# EAGLE design 8085_shadow (EAGLE 7.2.0)
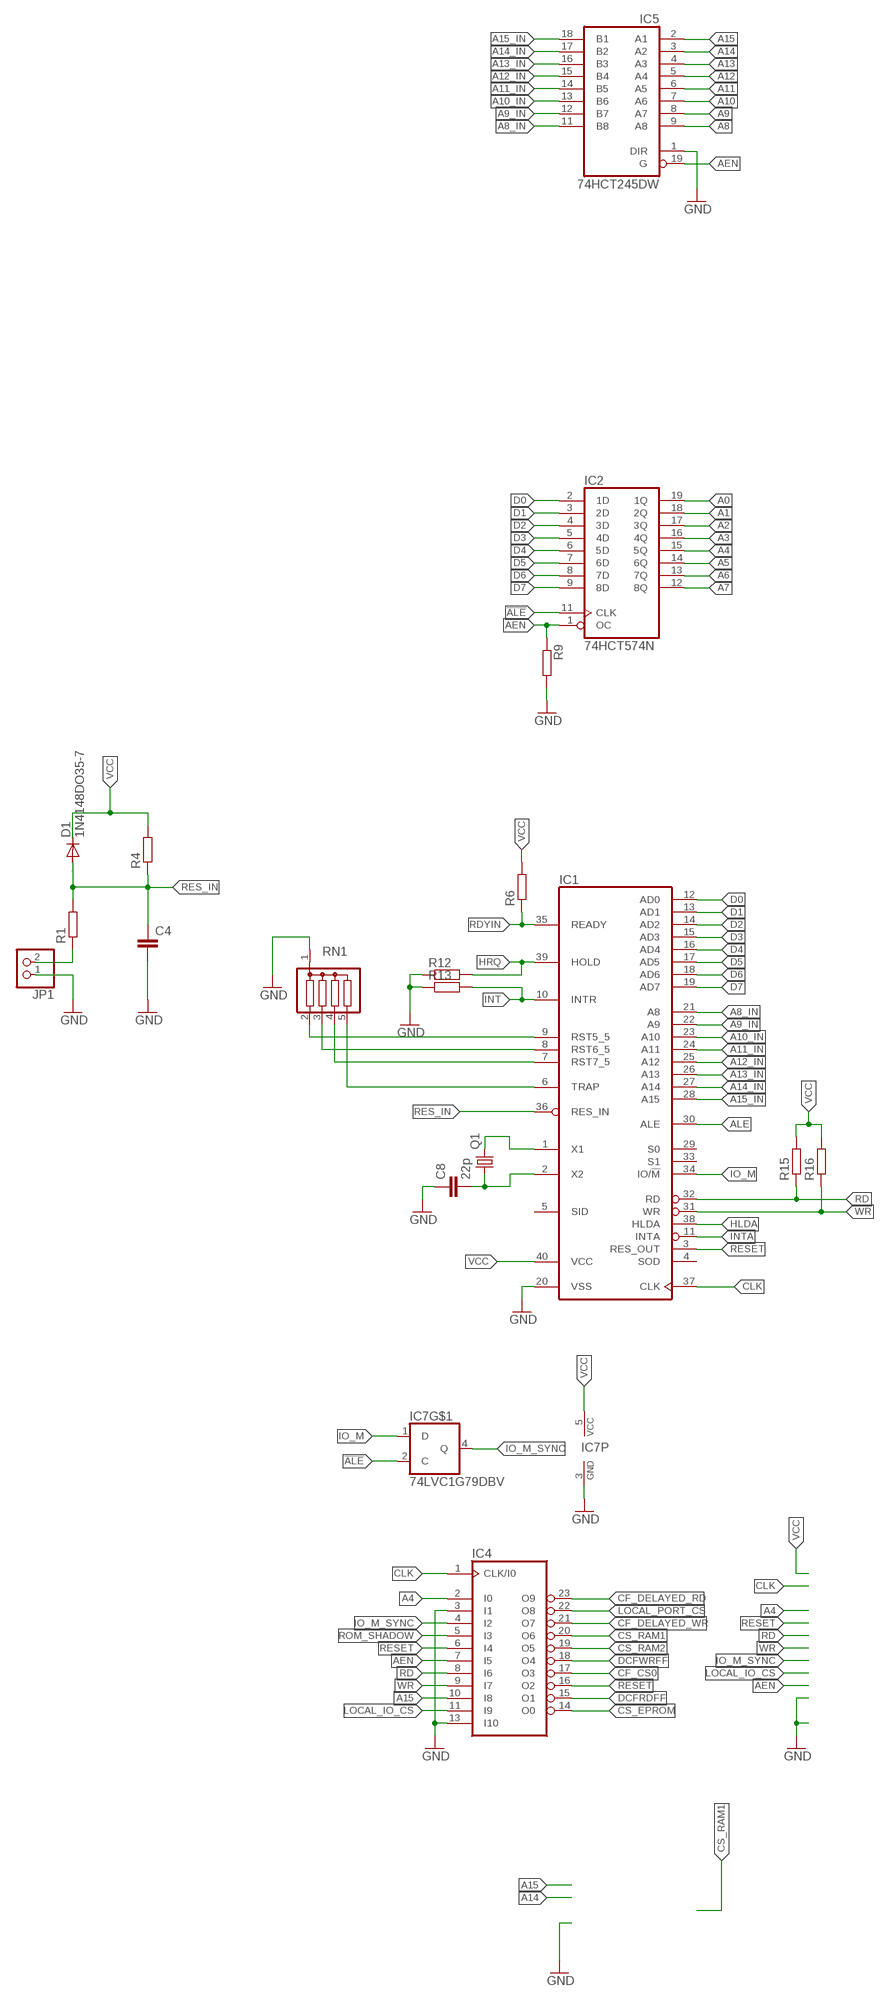
[diagram p0: schematic, sheet 1, part 1 of 3]
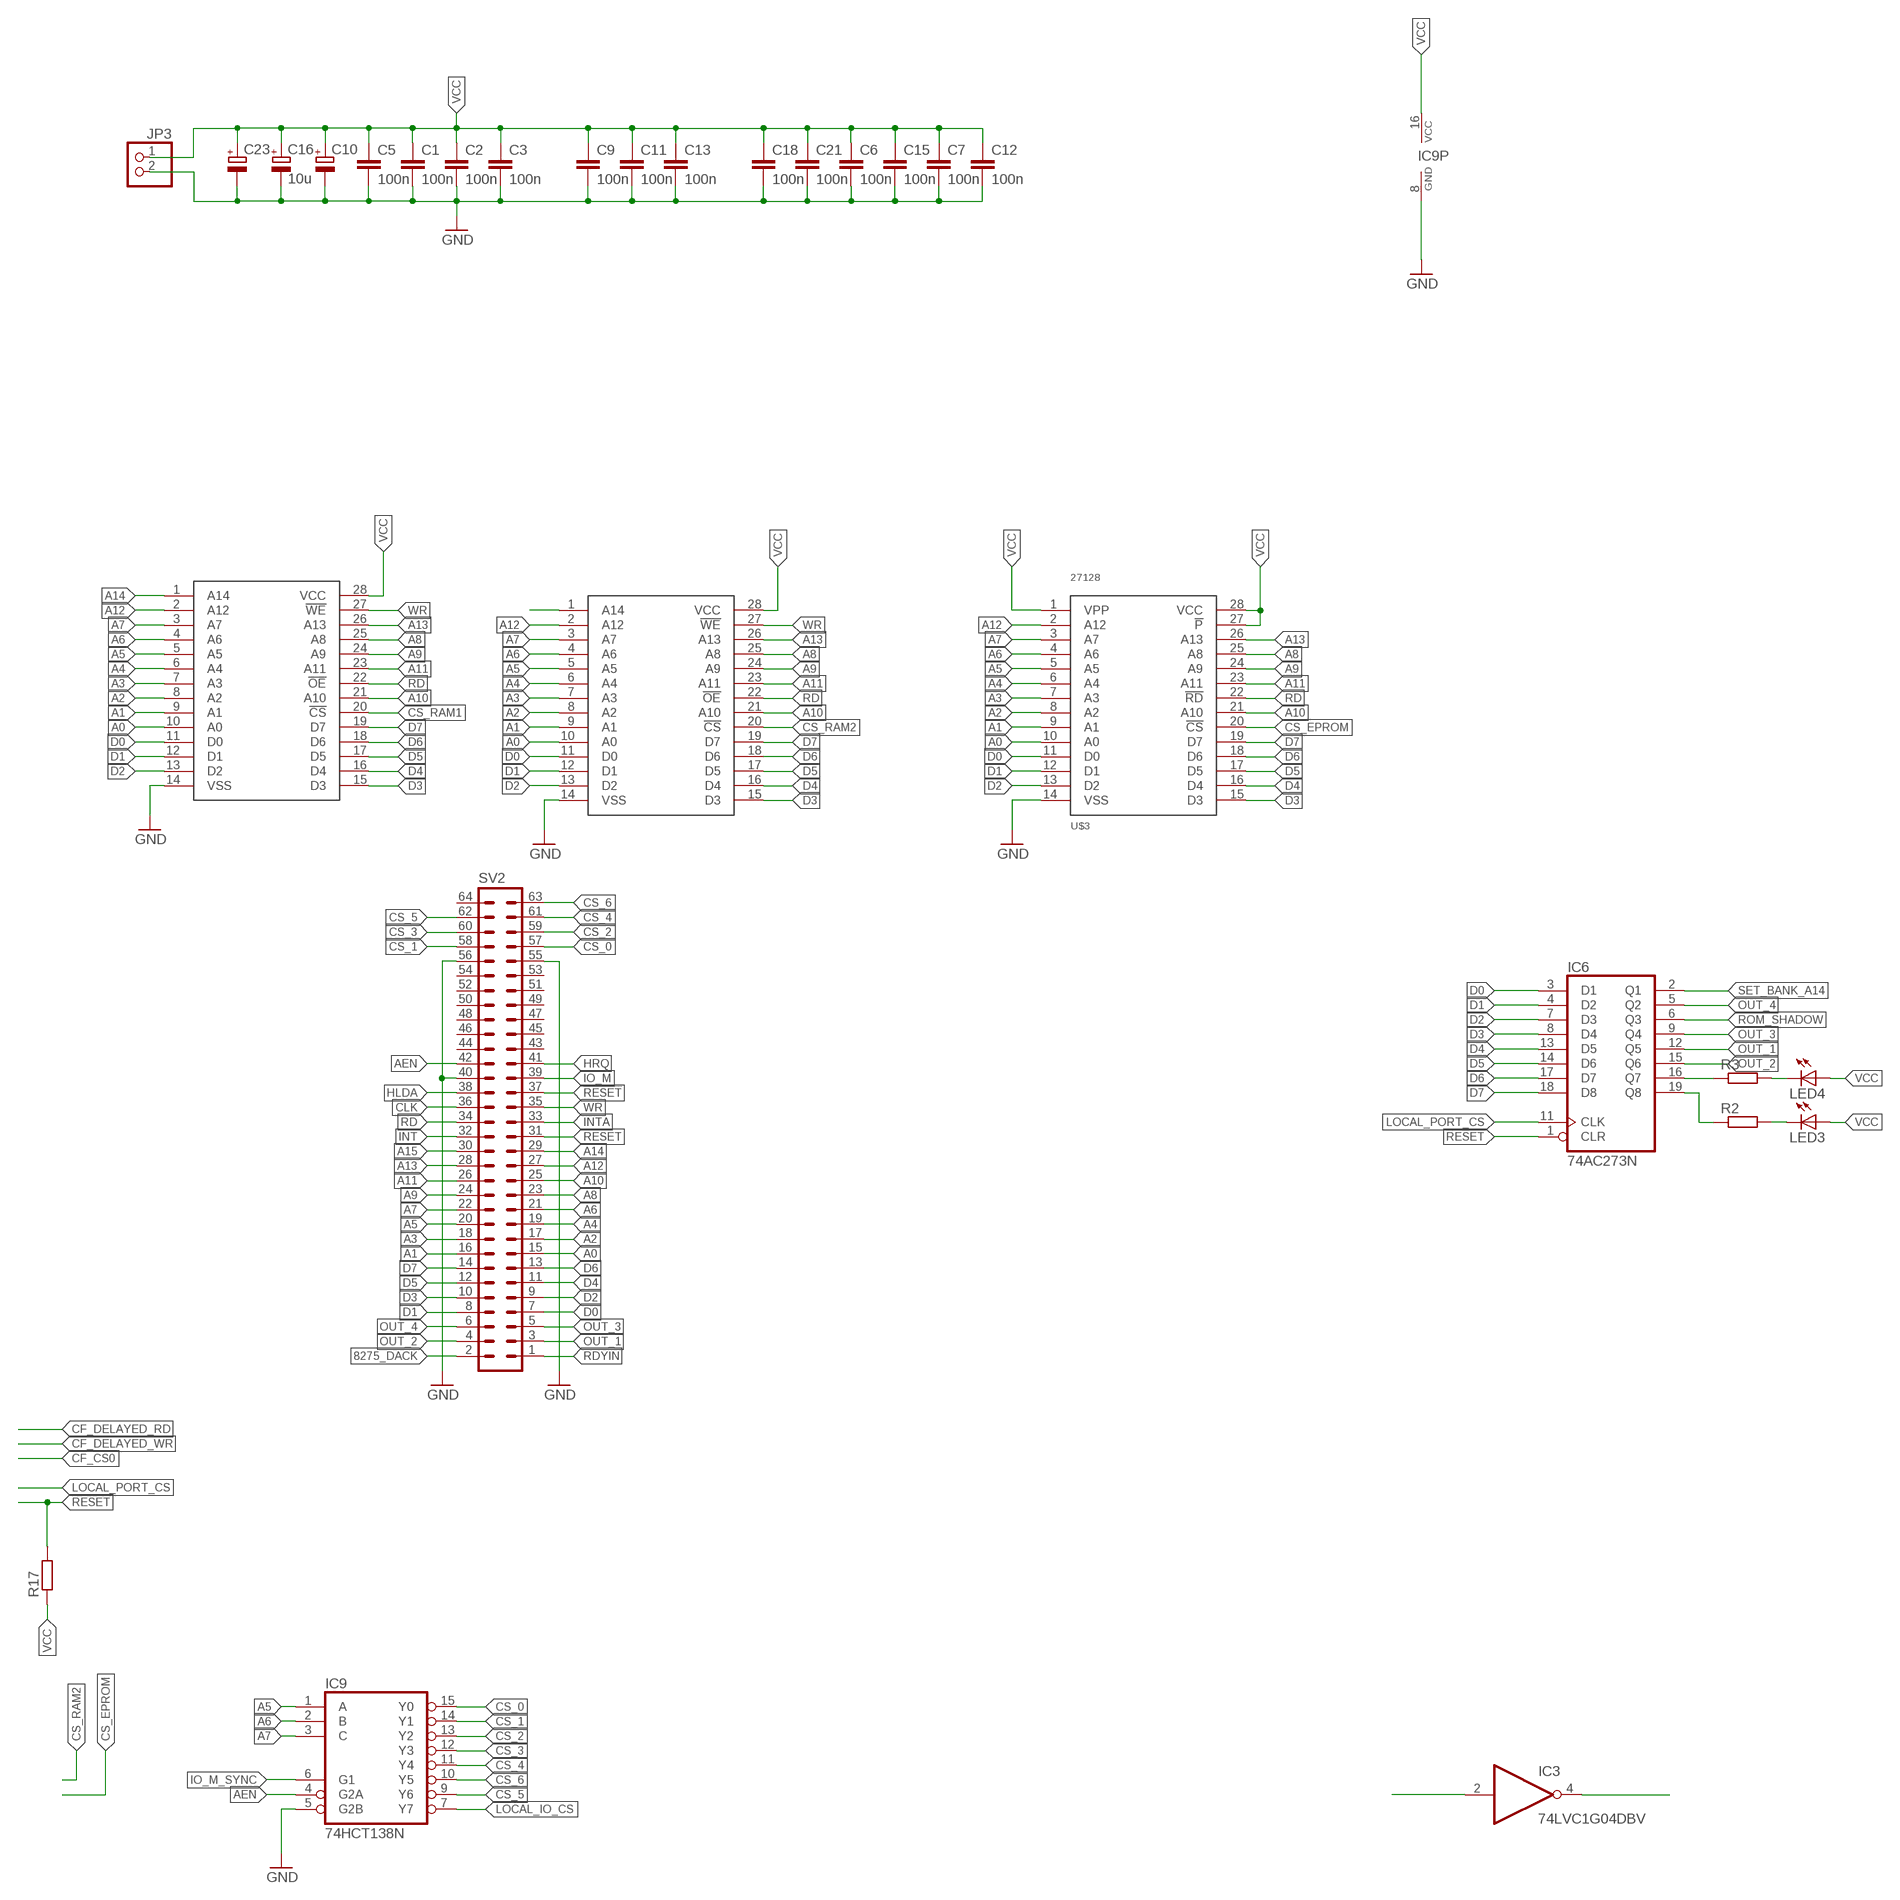
[diagram p1: schematic, sheet 1, part 2 of 3]
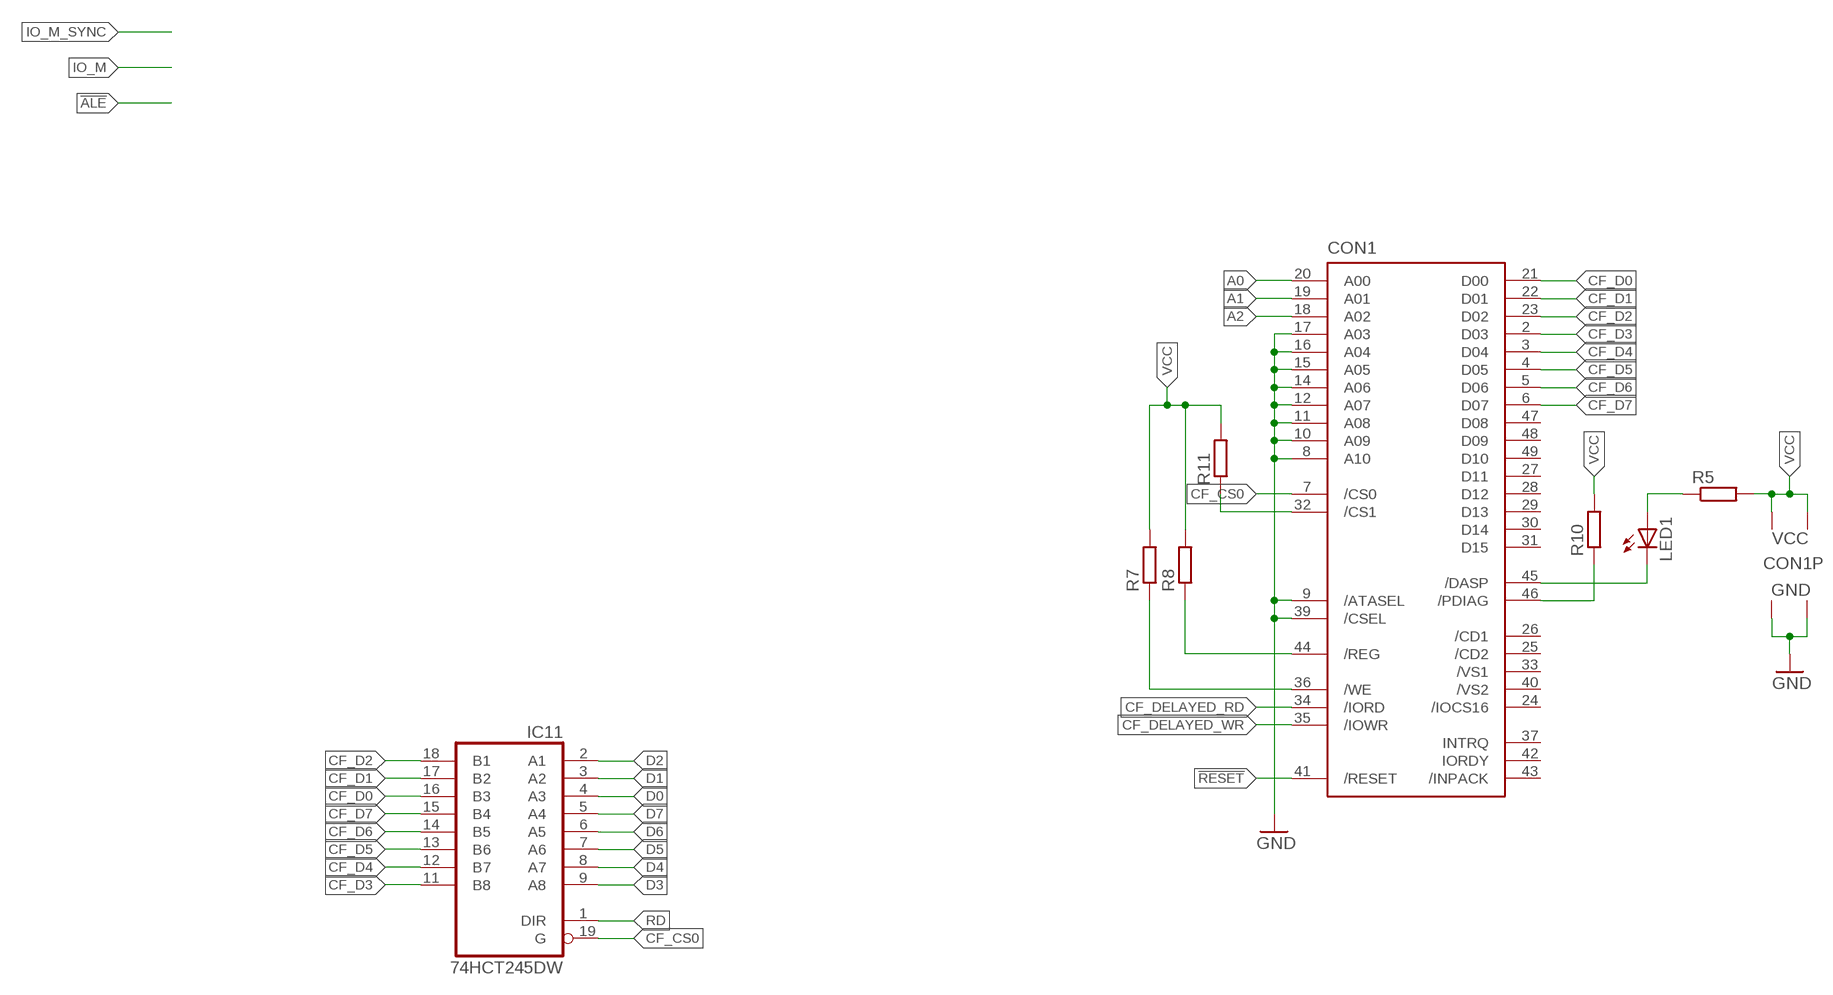
[diagram p2: schematic, sheet 1, part 3 of 3]

## Parts
C1  100n  C-EUC0805  [C0805]
C2  100n  C-EUC0805  [C0805]
C3  100n  C-EUC0805  [C0805]
C4  C-EUC0603  [C0603]
C5  100n  C-EUC0603  [C0603]
C6  100n  C-EUC0603  [C0603]
C7  100n  C-EUC0603  [C0603]
C8  22p  C-EUC0603  [C0603]
C9  100n  C-EUC1206  [C1206]
C10  CPOL-EUE5-10.5  [E5-10,5]
C11  100n  C-EUC0805  [C0805]
C12  100n  C-EUC0805  [C0805]
C13  100n  C-EUC0805  [C0805]
C15  100n  C-EUC0603  [C0603]
C16  10u  CPOL-EUSMCB  [SMC_B]
C18  100n  C-EUC0603  [C0603]
C21  100n  C-EUC0603  [C0603]
C23  CPOL-EUE5-10.5  [E5-10,5]
CON1  CF-CARD-IDE_MODE  [MI20-50PD-SF]
D1  1N4148DO35-7  [DO35-7]
IC1  8085  [DIL40]
IC2  74HCT574N  [DIL20]
IC3  74LVC1G04DBV  [SOT23-5]
IC4  22V10  [DIL24-3]
IC5  74HCT245DW  [SO20W]
IC6  74AC273N  [DIL20]
IC7  74LVC1G79DBV  [SOT23-5]
IC9  74HCT138N  [DIL16]
IC11  74HCT245DW  [SO20W]
JP1  PINHD-1X2  [1X02]
JP3  PINHD-1X2  [1X02]
LED1  LED5MM  [LED5MM]
LED3  LED5MM  [LED5MM]
LED4  LED5MM  [LED5MM]
Q1  CRYSTALHC49S  [HC49/S]
R1  R-EU_0204/5  [0204/5]
R2  R-EU_R1206  [R1206]
R3  R-EU_R1206  [R1206]
R4  R-EU_0204/7  [0204/7]
R5  R-EU_R0603  [R0603]
R6  R-EU_0204/5  [0204/5]
R7  R-EU_0207/10  [0207/10]
R8  R-EU_0207/12  [0207/12]
R9  R-EU_R0603  [R0603]
R10  R-EU_0207/12  [0207/12]
R11  R-EU_0207/10  [0207/10]
R12  R-EU_R0603  [R0603]
R13  R-EU_R0603  [R0603]
R15  R-EU_0204/7  [0204/7]
R16  R-EU_0204/7  [0204/7]
R17  R-EU_0204/7  [0204/7]
RN1  G04R  [SIL5]
SV2  ML64L  [ML64L]
U$2  62256  [DIL28-6]
U$3  27128  [DIL28]
U$4  62256  [DIL28-6]

## Nets
8275_DACK: SV2.2
!ALE: IC2.11(CLK) IC3.4(O) IC7.2(C)
!RESET: CON1.41(/RESET) IC4.16(O2) IC6.1(CLR) R17.2 SV2.37
A0: CON1.20(A00) IC2.19(1Q) SV2.15 U$2.10(A0) U$3.10(A0) U$4.10(A0)
A1: CON1.19(A01) IC2.18(2Q) SV2.16 U$2.9(A1) U$3.9(A1) U$4.9(A1)
A2: CON1.18(A02) IC2.17(3Q) SV2.17 U$2.8(A2) U$3.8(A2) U$4.8(A2)
A3: IC2.16(4Q) SV2.18 U$2.7(A3) U$3.7(A3) U$4.7(A3)
A4: IC2.15(5Q) IC4.2(I0) SV2.19 U$2.6(A4) U$3.6(A4) U$4.6(A4)
A5: IC2.14(6Q) IC9.1(A) SV2.20 U$2.5(A5) U$3.5(A5) U$4.5(A5)
A6: IC2.13(7Q) IC9.2(B) SV2.21 U$2.4(A6) U$3.4(A6) U$4.4(A6)
A7: IC2.12(8Q) IC9.3(C) SV2.22 U$2.3(A7) U$3.3(A7) U$4.3(A7)
A8: IC5.9(A8) SV2.23 U$2.25(A8) U$3.25(A8) U$4.25(A8)
A8_IN: IC1.21(A8) IC5.11(B8)
A9: IC5.8(A7) SV2.24 U$2.24(A9) U$3.24(A9) U$4.24(A9)
A9_IN: IC1.22(A9) IC5.12(B7)
A10: IC5.7(A6) SV2.25 U$2.21(A10) U$3.21(A10) U$4.21(A10)
A10_IN: IC1.23(A10) IC5.13(B6)
A11: IC5.6(A5) SV2.26 U$2.23(A11) U$3.23(A11) U$4.23(A11)
A11_IN: IC1.24(A11) IC5.14(B5)
A12: IC5.5(A4) SV2.27 U$2.2(A12) U$3.2(A12) U$4.2(A12)
A12_IN: IC1.25(A12) IC5.15(B4)
A13: IC5.4(A3) SV2.28 U$2.26(A13) U$3.26(A13) U$4.26(A13)
A13_IN: IC1.26(A13) IC5.16(B3)
A14: IC5.3(A2) SV2.29 U$2.1(A14) U$4.1(A14)
A14_IN: IC1.27(A14) IC5.17(B2)
A15: IC4.10(I8) IC5.2(A1) SV2.30
A15_IN: IC1.28(A15) IC5.18(B1)
AEN: IC2.1(OC) IC4.7(I5) IC5.19(G) IC9.4(G2A) R9.1 SV2.42
ALE: IC1.30(ALE) IC3.2(I)
CF_CS0: CON1.7(/CS0) IC4.17(O3) IC11.19(G)
CF_D0: CON1.21(D00) IC11.16(B3)
CF_D1: CON1.22(D01) IC11.17(B2)
CF_D2: CON1.23(D02) IC11.18(B1)
CF_D3: CON1.2(D03) IC11.11(B8)
CF_D4: CON1.3(D04) IC11.12(B7)
CF_D5: CON1.4(D05) IC11.13(B6)
CF_D6: CON1.5(D06) IC11.14(B5)
CF_D7: CON1.6(D07) IC11.15(B4)
CF_DELAYED_RD: CON1.34(/IORD) IC4.23(O9)
CF_DELAYED_WR: CON1.35(/IOWR) IC4.21(O7)
CLK: IC1.37(CLK) IC4.1(CLK/I0) SV2.36
CS_0: IC9.15(Y0) SV2.57
CS_1: IC9.14(Y1) SV2.58
CS_2: IC9.13(Y2) SV2.59
CS_3: IC9.12(Y3) SV2.60
CS_4: IC9.11(Y4) SV2.61
CS_5: IC9.9(Y6) SV2.62
CS_6: IC9.10(Y5) SV2.63
CS_EPROM: IC4.14(O0) U$3.20(!CS)
CS_RAM1: IC4.20(O6) U$4.20(!CS)
CS_RAM2: IC4.19(O5) U$2.20(!CS)
D0: IC1.12(AD0) IC2.2(1D) IC6.3(D1) IC11.4(A3) SV2.7 U$2.11(D0) U$3.11(D0) U$4.11(D0)
D1: IC1.13(AD1) IC2.3(2D) IC6.4(D2) IC11.3(A2) SV2.8 U$2.12(D1) U$3.12(D1) U$4.12(D1)
D2: IC1.14(AD2) IC2.4(3D) IC6.7(D3) IC11.2(A1) SV2.9 U$2.13(D2) U$3.13(D2) U$4.13(D2)
D3: IC1.15(AD3) IC2.5(4D) IC6.8(D4) IC11.9(A8) SV2.10 U$2.15(D3) U$3.15(D3) U$4.15(D3)
D4: IC1.16(AD4) IC2.6(5D) IC6.13(D5) IC11.8(A7) SV2.11 U$2.16(D4) U$3.16(D4) U$4.16(D4)
D5: IC1.17(AD5) IC2.7(6D) IC6.14(D6) IC11.7(A6) SV2.12 U$2.17(D5) U$3.17(D5) U$4.17(D5)
D6: IC1.18(AD6) IC2.8(7D) IC6.17(D7) IC11.6(A5) SV2.13 U$2.18(D6) U$3.18(D6) U$4.18(D6)
D7: IC1.19(AD7) IC2.9(8D) IC6.18(D8) IC11.5(A4) SV2.14 U$2.19(D7) U$3.19(D7) U$4.19(D7)
DCFRDFF: IC4.15(O1)
DCFWRFF: IC4.18(O4)
GND: C1.2 C2.2 C3.2 C4.2 C5.2 C6.2 C7.2 C8.1 C9.2 C10.- C11.2 C12.2 C13.2 C15.2 C16.- C18.2 C21.2 C23.- CON1.1(GND1) CON1.8(A10) CON1.9(/ATASEL) CON1.10(A09) CON1.11(A08) CON1.12(A07) CON1.14(A06) CON1.15(A05) CON1.16(A04) CON1.17(A03) CON1.39(/CSEL) CON1.50(GND2) IC1.20(VSS) IC4.3(I1) IC4.13(I10) IC5.1(DIR) IC7.3(GND) IC9.5(G2B) IC9.8(GND) JP1.1 JP3.2 R9.2 R12.1 R13.1 RN1.1 SV2.40 SV2.55 SV2.56 U$2.14(VSS) U$3.14(VSS) U$4.14(VSS)
HLDA: IC1.38(HLDA) SV2.38
HRQ: IC1.39(HOLD) R12.2 SV2.41
INT: IC1.10(INTR) R13.2 SV2.32
INTA: IC1.11(INTA) SV2.33
IO_M: IC1.34(IO/!M) IC7.1(D) SV2.39
IO_M_SYNC: IC4.4(I2) IC7.4(Q) IC9.6(G1)
LOCAL_IO_CS: IC4.11(I9) IC9.7(Y7)
LOCAL_PORT_CS: IC4.22(O8) IC6.11(CLK)
N$1: IC1.1(X1) Q1.2
N$2: C8.2 IC1.2(X2) Q1.1
N$3: IC1.9(RST5_5) RN1.2
N$4: IC1.8(RST6_5) RN1.3
N$5: IC6.16(Q7) R3.1
N$6: IC1.7(RST7_5) RN1.4
N$7: IC1.6(TRAP) RN1.5
N$8: LED3.K(C) R2.2
N$9: LED4.K(C) R3.2
N$10: IC6.19(Q8) R2.1
N$11: CON1.44(/REG) R8.1
N$12: CON1.36(/WE) R7.1
N$13: CON1.46(/PDIAG) R10.1
N$14: JP1.2 R1.1
N$15: LED1.A R5.1
N$16: CON1.45(/DASP) LED1.K(C)
N$29: CON1.32(/CS1) R11.1
OUT_1: IC6.12(Q5) SV2.3
OUT_2: IC6.15(Q6) SV2.4
OUT_3: IC6.9(Q4) SV2.5
OUT_4: IC6.5(Q2) SV2.6
RD: IC1.32(RD) IC4.8(I6) IC11.1(DIR) R15.1 SV2.34 U$2.22(!OE) U$3.22(!RD) U$4.22(!OE)
RDYIN: IC1.35(READY) R6.1 SV2.1
RES_IN: C4.1 D1.A IC1.36(RES_IN) R1.2 R4.1
RESET: IC1.3(RES_OUT) IC4.6(I4) SV2.31
ROM_SHADOW: IC4.5(I3) IC6.6(Q3)
SET_BANK_A14: IC6.2(Q1)
VCC: C1.1 C2.1 C3.1 C5.1 C6.1 C7.1 C9.1 C10.+ C11.1 C12.1 C13.1 C15.1 C16.+ C18.1 C21.1 C23.+ CON1.13(VCC2) CON1.38(VCC1) D1.C IC1.40(VCC) IC7.5(VCC) IC9.16(VCC) JP3.1 LED3.A LED4.A R4.2 R5.2 R6.2 R7.2 R8.2 R10.2 R11.2 R15.2 R16.2 R17.1 U$2.28(VCC) U$3.1(VPP) U$3.27(!P) U$3.28(VCC) U$4.28(VCC)
WR: IC1.31(WR) IC4.9(I7) R16.1 SV2.35 U$2.27(!WE) U$4.27(!WE)
Unconnected: CON1.24(/IOCS16) CON1.25(/CD2) CON1.26(/CD1) CON1.27(D11) CON1.28(D12) CON1.29(D13) CON1.30(D14) CON1.31(D15) CON1.33(/VS1) CON1.37(INTRQ) CON1.40(/VS2) CON1.42(IORDY) CON1.43(/INPACK) CON1.47(D08) CON1.48(D09) CON1.49(D10) IC1.4(SOD) IC1.5(SID) IC1.29(S0) IC1.33(S1) SV2.43 SV2.44 SV2.45 SV2.46 SV2.47 SV2.48 SV2.49 SV2.50 SV2.51 SV2.52 SV2.53 SV2.54 SV2.64

## Power pins joined to a net without a drawn wire
GND: IC2.10(GND) IC3.3(GND) IC4.12(GND) IC5.10(GND) IC6.10(GND) IC11.10(GND)
VCC: IC2.20(VCC) IC3.5(VCC) IC4.24(VCC) IC5.20(VCC) IC6.20(VCC) IC11.20(VCC)

## Library data of the parts
C1-C9 C11-C13 C15 C18 C21 = rcl:C-EU: CAPACITOR, European symbol
C10 C16 C23 = rcl:CPOL-EU: POLARIZED CAPACITOR, European symbol
CON1 = con-hirose:CF-CARD-IDE_MODE: Compact Flash Adapter Type I or II without Eject Button Source: con-hirose.lbr from Bob Starr <rtzaudio@mindspring.com>; OC_FARNELL: unknown; OC_NEWARK: unknown
D1 = diode:1N4148: DIODE high speed (Philips)
IC1 = micro-intel:8085: MICROCOMPUTER/PERIPHERAL DEVICE; OC_FARNELL: unknown; OC_NEWARK: unknown
IC2 = 74xx-eu:74*574: 8-bit D type FLIP FLOP bus driver
IC3 = 74xx-little-us:74*1G04: INVERTER Gate
IC4 = pal:22V10: PAL; MPN: GAL22V10D-7LPN; OC_FARNELL: 1571925; OC_NEWARK: 97M0480
IC5 IC11 = 74xx-eu:74*245: Octal BUS TRANSCEIVER, 3-state
IC6 = 74xx-eu:74*273: Octal D type FLIP FLOP, clear
IC7 = 74xx-little-de:74*1G79: Single Positive-Edge-Triggered D-Type Flip-Flop Source: Data sheet <http://www.ti.com/lit/ds/symlink/sn74lvc1g79.pdf>
IC9 = 74xx-eu:74*138: 3-line to 8-line DECODER/DEMULTIPLEXER
JP1 JP3 = pinhead:PINHD-1X2: PIN HEADER
LED1 LED3 LED4 = led:LED: LED OSRAM: - CHIPLED LG R971, LG N971, LY N971, LG Q971, LY Q971, LO R971, LY R971 LH N974, LH R974 LS Q976, LO Q976, LY Q976 LO Q996 - Hyper CHIPLED LW Q18S LB Q993, LB Q99A, LB R99A - SideLED LS A670, LO A670, LY A670, LG A670, LP A670 LB A673, LV A673, LT A673, LW A673 LH A674 LY A675 LS A676, LA A676, LO A676, LY A676, LW A676 LS A679, LY A679, LG A679 - Hyper Micro SIDELED® LS Y876, LA Y876, LO Y876, LY Y876 LT Y87S - SmartLED LW L88C, LW L88S LB L89C, LB L89S, LG L890 LS L89K, LO L89K, LY L89K LS L896, LA L896, LO L896, LY L896 - TOPLED LS T670, LO T670, LY T670, LG T670, LP T670 LSG T670, LSP T670, LSY T670, LOP T670, LYG T670 LG T671, LOG T671, LSG T671 LB T673, LV T673, LT T673, LW T673 LH T674 LS T676, LA T676, LO T676, LY T676, LB T676, LH T676, LSB T676, LW T676 LB T67C, LV T67C, LT T67C, LS T67K, LO T67K, LY T67K, LW E67C LS E67B, LA E67B, LO E67B, LY E67B, LB E67C, LV E67C, LT E67C LW T67C LS T679, LY T679, LG T679 LS T770, LO T770, LY T770, LG T770, LP T770 LB T773, LV T773, LT T773, LW T773 LH T774 LS E675, LA E675, LY E675, LS T675 LS T776, LA T776, LO T776, LY T776, LB T776 LHGB T686 LT T68C, LB T68C - Hyper Mini TOPLED® LB M676 - Mini TOPLED Santana® LG M470 LS M47K, LO M47K, LY M47K Source: http://www.osram.convergy.de LUXEON: - LUMILED® LXK2-PW12-R00, LXK2-PW12-S00, LXK2-PW14-U00, LXK2-PW14-V00 LXK2-PM12-R00, LXK2-PM12-S00, LXK2-PM14-U00 LXK2-PE12-Q00, LXK2-PE12-R00, LXK2-PE12-S00, LXK2-PE14-T00, LXK2-PE14-U00 LXK2-PB12-K00, LXK2-PB12-L00, LXK2-PB12-M00, LXK2-PB14-N00, LXK2-PB14-P00, LXK2-PB14-Q00 LXK2-PR12-L00, LXK2-PR12-M00, LXK2-PR14-Q00, LXK2-PR14-R00 LXK2-PD12-Q00, LXK2-PD12-R00, LXK2-PD12-S00 LXK2-PH12-R00, LXK2-PH12-S00 LXK2-PL12-P00, LXK2-PL12-Q00, LXK2-PL12-R00 Source: www.luxeon.com KINGBRIGHT: KA-3528ASYC Source: www.kingbright.com
Q1 = crystal:CRYSTAL: CRYSTAL; OC_FARNELL: 1667008; OC_NEWARK: unknown
R1-R13 R15-R17 = rcl:R-EU_: RESISTOR, European symbol
RN1 = resistor-sil:G04R: SIL RESISTOR; OC_FARNELL: unknown; OC_NEWARK: unknown
SV2 = con-harting-ml:ML64: HARTING; OC_FARNELL: unknown; OC_NEWARK: unknown
U$2 U$4 = memory-sram:62256
U$3 = mw:27128

## Board
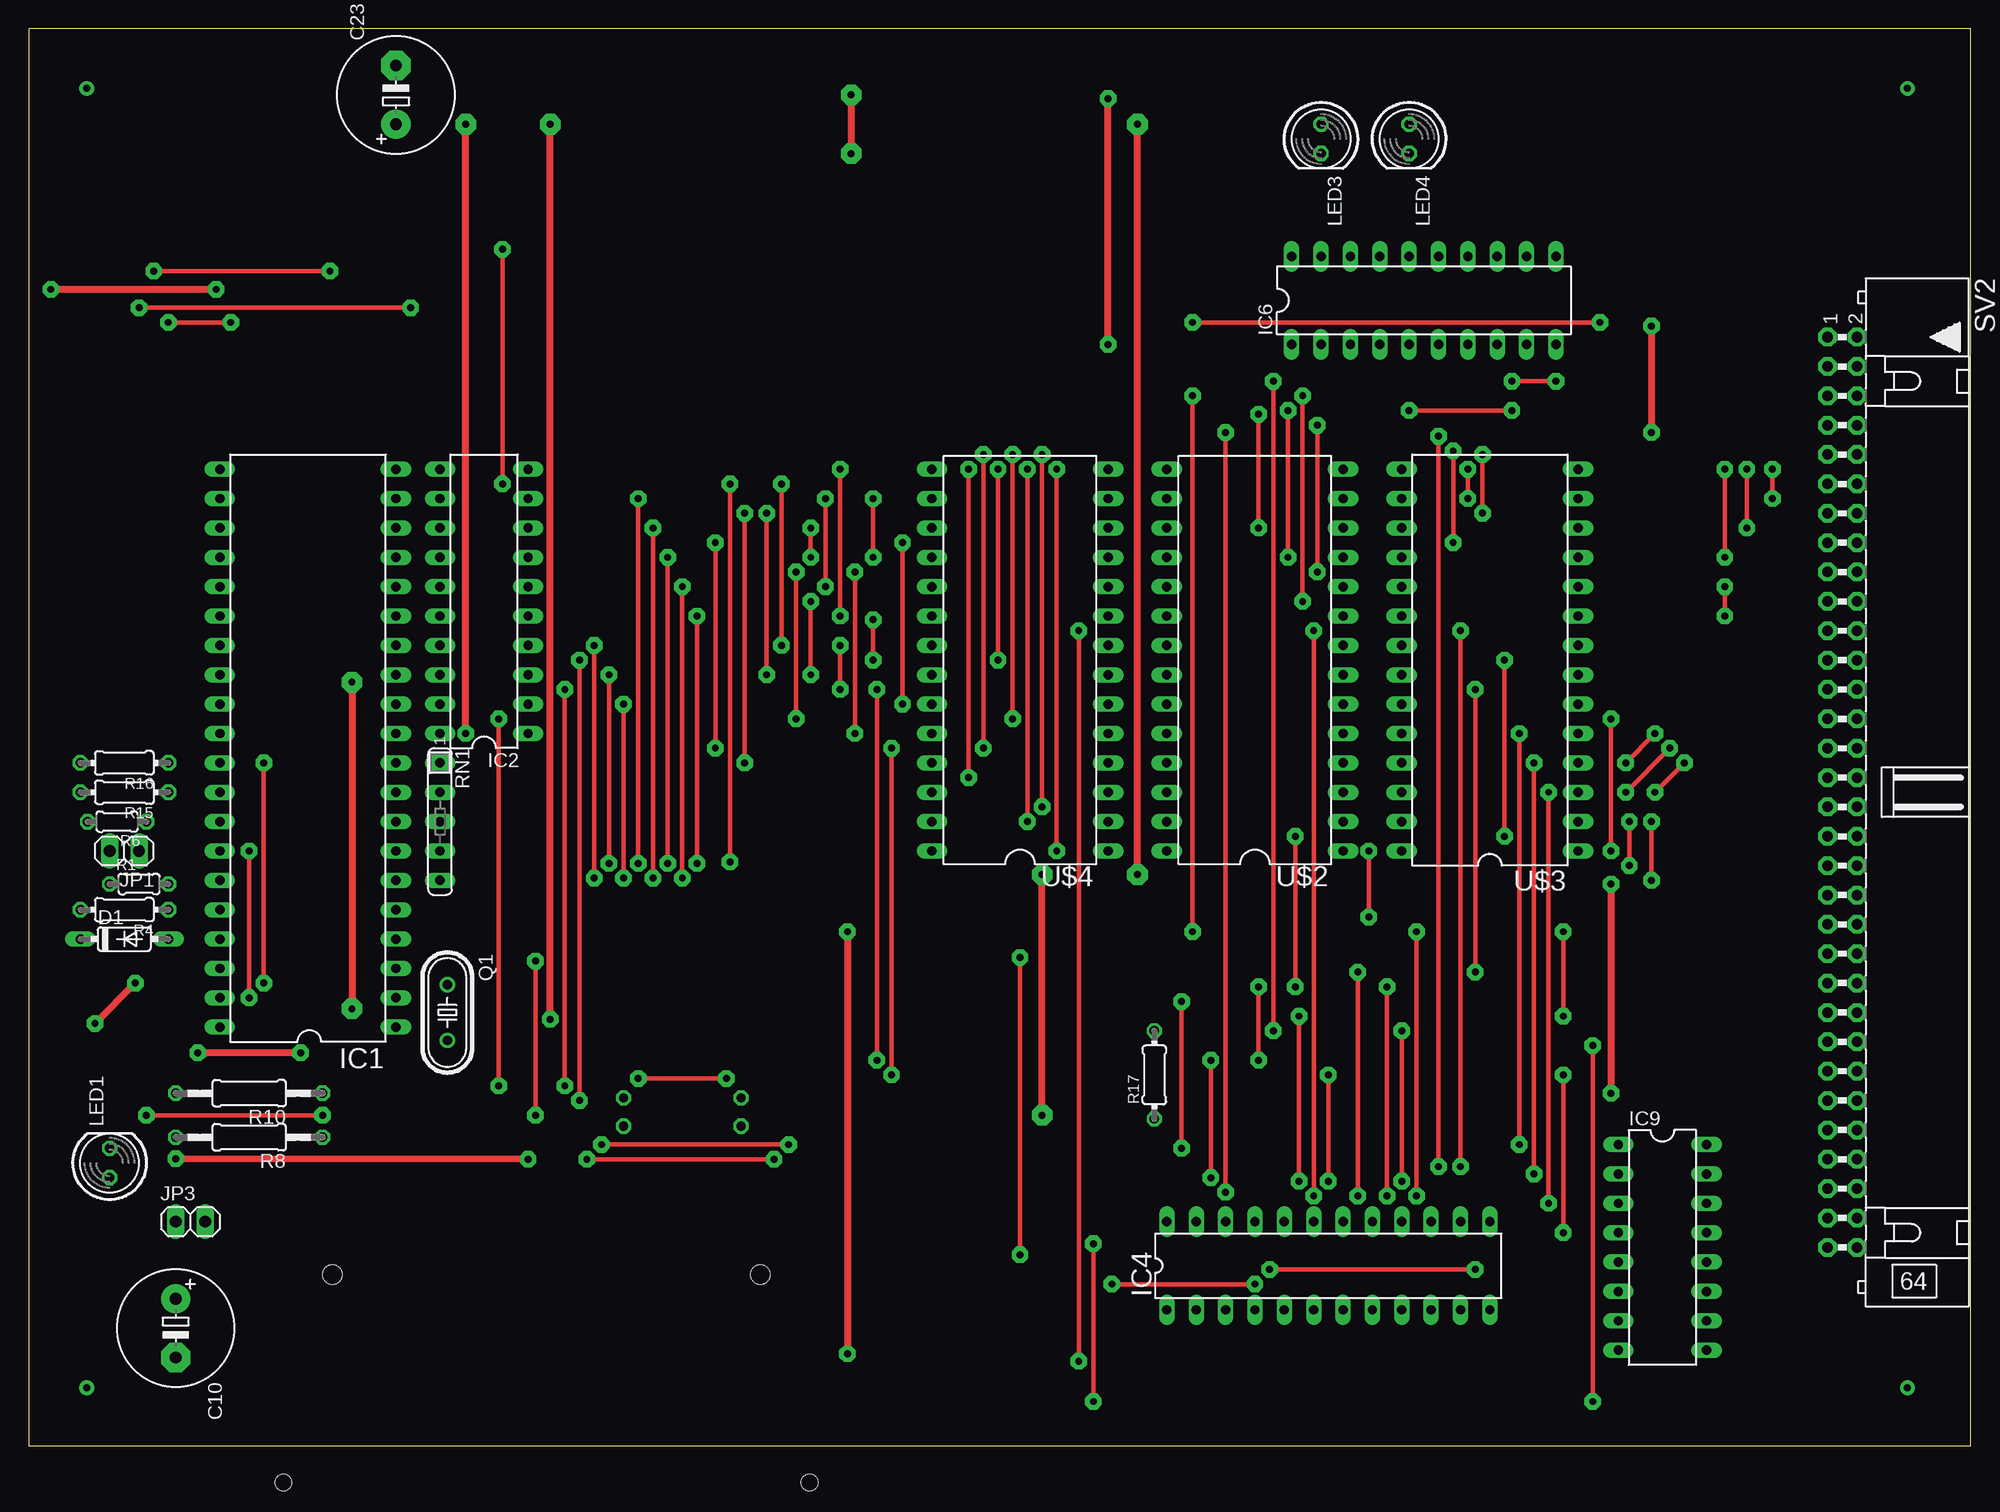
[diagram p3: board, top side]
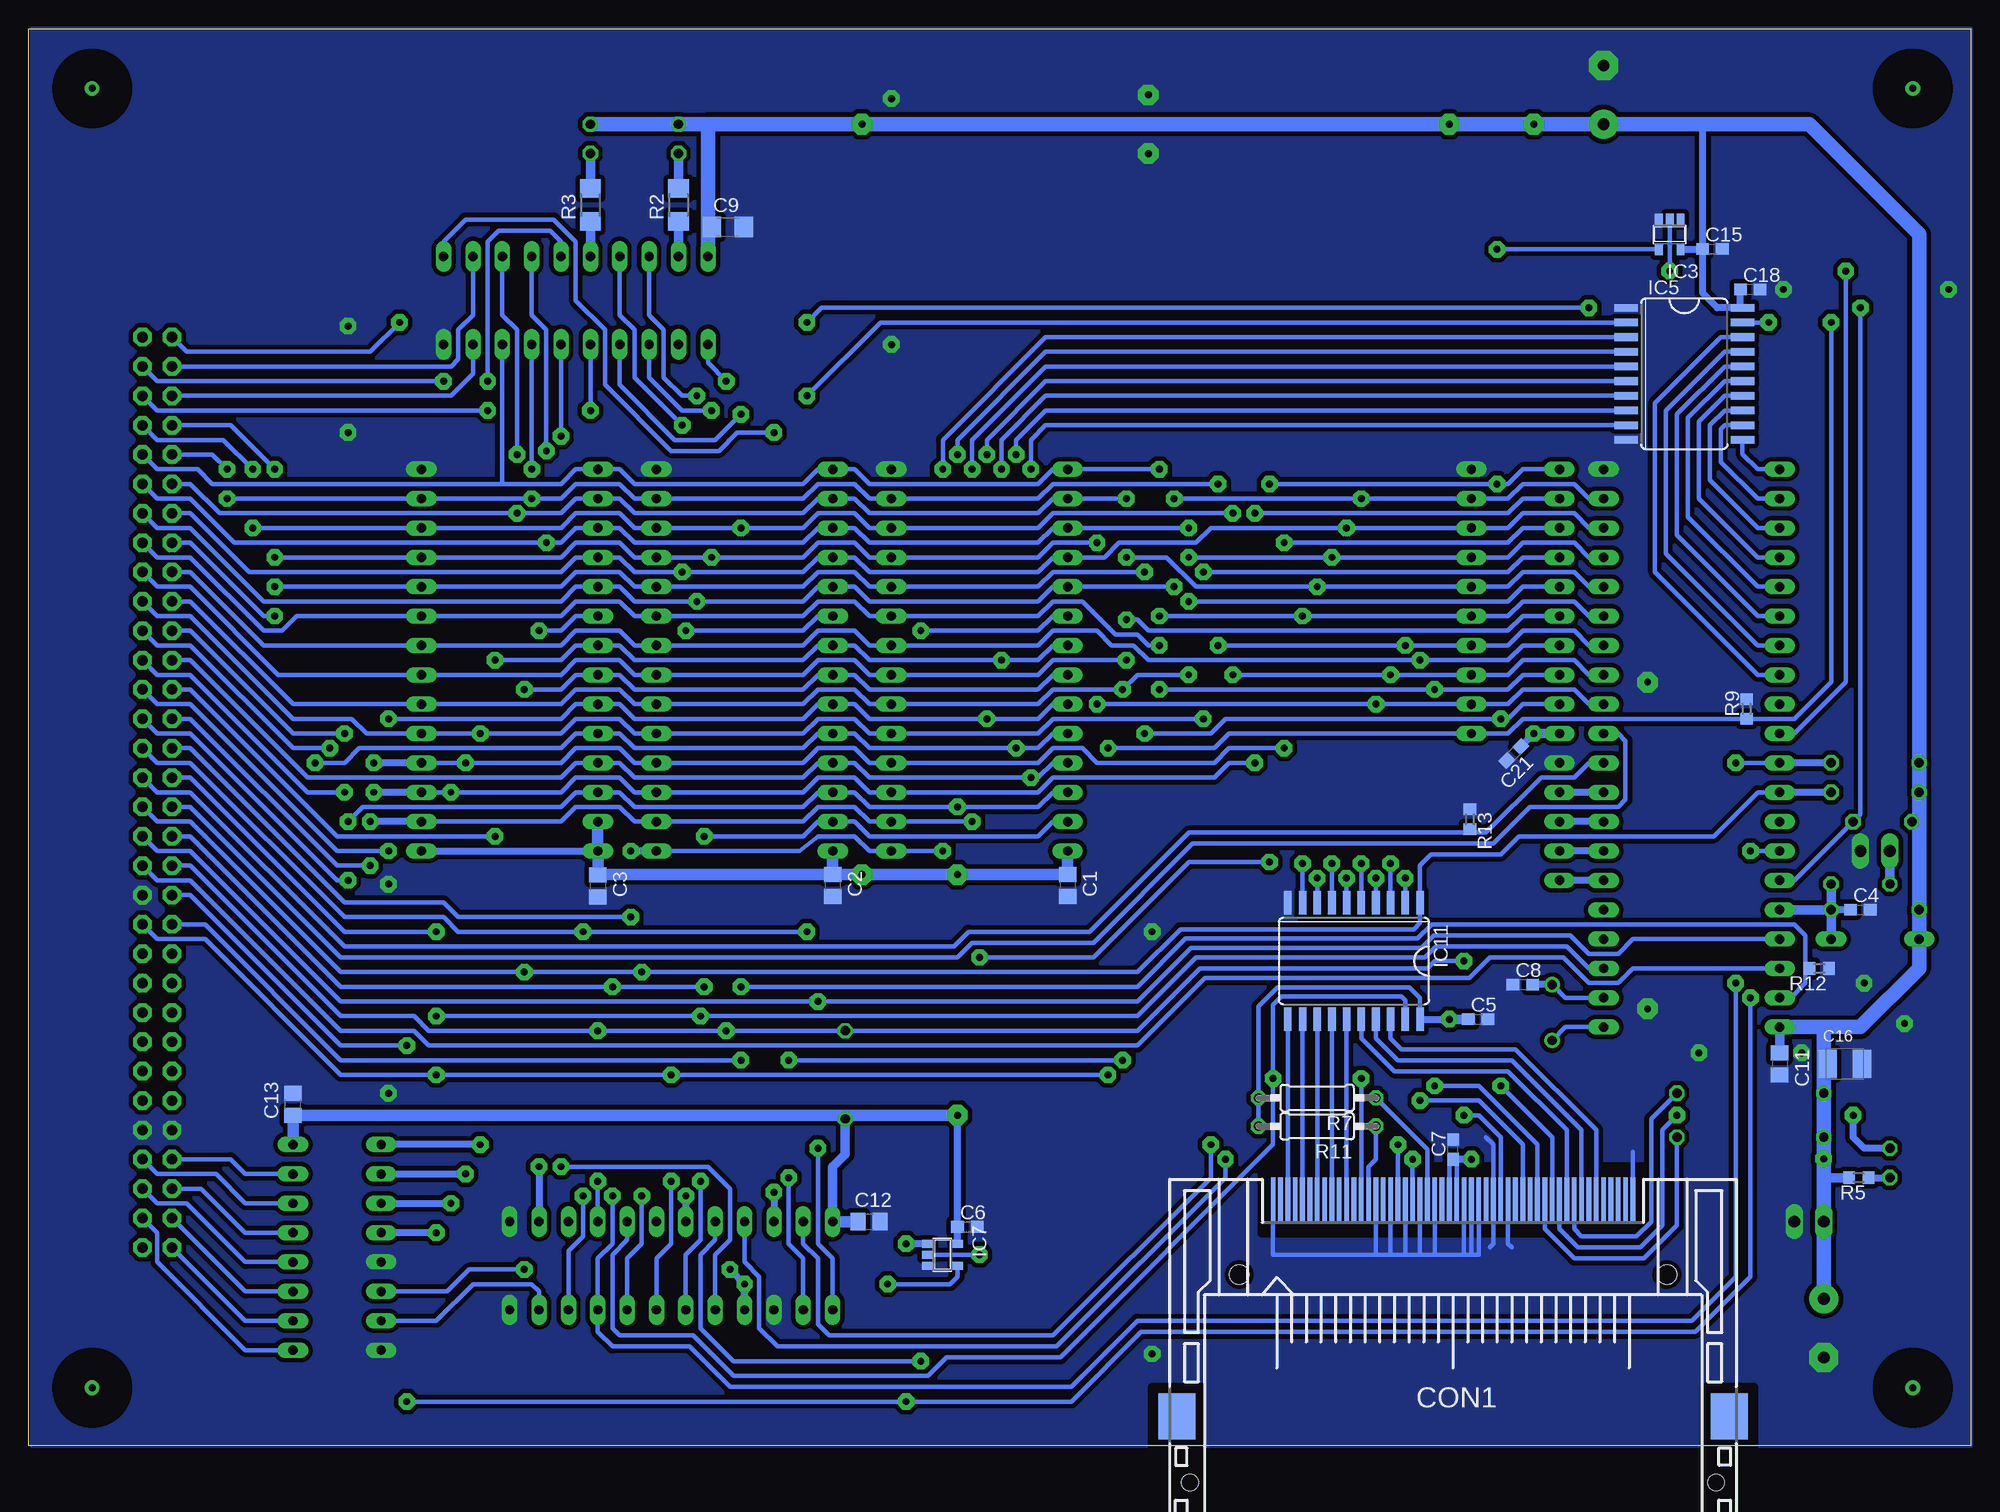
[diagram p4: board, bottom side, seen from below]

Size 167.94 x 122.55 mm. Coordinates in mm from the lower left corner, seen from the top.
Outline: 0,0 167.94,0 167.94,122.55 0,122.55 0,0
Copper layers (1*16): Top 0.035mm / dielectric 1.5mm / Bottom 0.035mm
Design rules "default *": minimum track width 10mil, minimum drill 24mil, track to track 8mil, track to pad 8mil, pad to pad 8mil, via to via 8mil, smd to smd 8mil, copper to edge 0mil, drill to drill 8mil, minimum pad ring 10mil, minimum via ring 8mil, stop-mask expansion 4mil, vias tented up to drill 0mil, thermal gap 10mil
bRestrict: area 2,2 to 8,8; area 2,114.3 to 8,120.4; area 159.4,2 to 165.5,8; area 159.4,114.3 to 165.5,120.4; area 28.3,18.4 to 61.3,24.1

### Footprints (pad centres in the part's own frame; a part is rotated, then mirrored left to right if it is on the bottom)
C0805 = smd 1.3 x 1.5: 1 -0.95,0; 2 0.95,0
C0603 = smd 1.1 x 1: 1 -0.85,0; 2 0.85,0
C1206 = smd 1.6 x 1.8: 1 -1.4,0; 2 1.4,0
E5-10,5 = drill 1.016 pad 2.54: + -2.54,0 | drill 1.016 pad 2.54 octagon: - 2.54,0
SMC_B = smd 1.6 x 2.4: + -1.5,0; - 1.5,0
MI20-50PD-SF = smd 0.41 x 3.75: 1 15.557,-18.78; 2 14.287,-18.78; 3 13.018,-18.78; 4 11.748,-18.78; 5 10.477,-18.78; 6 9.207,-18.78; 7 7.938,-18.78; 8 6.668,-18.78; 9 5.397,-18.78; 10 4.128,-18.78; 11 2.857,-18.78; 12 1.587,-18.78; 13 0.318,-18.78; 14 -0.953,-18.78; 15 -2.223,-18.78; 16 -3.493,-18.78; 17 -4.763,-18.78; 18 -6.032,-18.78; 19 -7.303,-18.78; 20 -8.572,-18.78; 21 -9.842,-18.78; 22 -11.113,-18.78; 23 -12.383,-18.78; 24 -13.652,-18.78; 25 -14.922,-18.78; 26 14.922,-18.78; 27 13.652,-18.78; 28 12.383,-18.78; 29 11.113,-18.78; 30 9.842,-18.78; 31 8.572,-18.78; 32 7.303,-18.78; 33 6.032,-18.78; 34 4.763,-18.78; 35 3.493,-18.78; 36 2.223,-18.78; 37 0.953,-18.78; 38 -0.318,-18.78; 39 -1.587,-18.78; 40 -2.857,-18.78; 41 -4.128,-18.78; 42 -5.397,-18.78; 43 -6.668,-18.78; 44 -7.938,-18.78; 45 -9.207,-18.78; 46 -10.477,-18.78; 47 -11.748,-18.78; 48 -13.018,-18.78; 49 -14.287,-18.78; 50 -15.557,-18.78 | smd 3.2 x 4: M1 -23.883,-0.005; M2 23.883,-0.005 | hole 1.676: 18.5,-12.25; -18.5,-12.25 | hole 1.422: -22.75,5.75; 22.75,5.75
DO35-7 = drill 0.813 long: A 3.81,0; C -3.81,0
DIL40 = drill 0.813 long: 1 -24.13,-7.62; 2 -21.59,-7.62; 3 -19.05,-7.62; 4 -16.51,-7.62; 5 -13.97,-7.62; 6 -11.43,-7.62; 7 -8.89,-7.62; 8 -6.35,-7.62; 9 -3.81,-7.62; 10 -1.27,-7.62; 11 1.27,-7.62; 12 3.81,-7.62; 13 6.35,-7.62; 14 8.89,-7.62; 15 11.43,-7.62; 16 13.97,-7.62; 17 16.51,-7.62; 18 19.05,-7.62; 19 21.59,-7.62; 20 24.13,-7.62; 21 24.13,7.62; 22 21.59,7.62; 23 19.05,7.62; 24 16.51,7.62; 25 13.97,7.62; 26 11.43,7.62; 27 8.89,7.62; 28 6.35,7.62; 29 3.81,7.62; 30 1.27,7.62; 31 -1.27,7.62; 32 -3.81,7.62; 33 -6.35,7.62; 34 -8.89,7.62; 35 -11.43,7.62; 36 -13.97,7.62; 37 -16.51,7.62; 38 -19.05,7.62; 39 -21.59,7.62; 40 -24.13,7.62
DIL20 = drill 0.813 long: 1 -11.43,-3.81; 2 -8.89,-3.81; 3 -6.35,-3.81; 4 -3.81,-3.81; 5 -1.27,-3.81; 6 1.27,-3.81; 7 3.81,-3.81; 8 6.35,-3.81; 9 8.89,-3.81; 10 11.43,-3.81; 11 11.43,3.81; 12 8.89,3.81; 13 6.35,3.81; 14 3.81,3.81; 15 1.27,3.81; 16 -1.27,3.81; 17 -3.81,3.81; 18 -6.35,3.81; 19 -8.89,3.81; 20 -11.43,3.81
SOT23-5 = smd 0.69 x 0.99: 1 -0.95,-1.29; 2 0,-1.29; 3 0.95,-1.29; 4 0.95,1.3; 5 -0.95,1.3
DIL24-3 = drill 0.813 long: 1 -13.97,-3.81; 2 -11.43,-3.81; 3 -8.89,-3.81; 4 -6.35,-3.81; 5 -3.81,-3.81; 6 -1.27,-3.81; 7 1.27,-3.81; 8 3.81,-3.81; 9 6.35,-3.81; 10 8.89,-3.81; 11 11.43,-3.81; 12 13.97,-3.81; 13 13.97,3.81; 14 11.43,3.81; 15 8.89,3.81; 16 6.35,3.81; 17 3.81,3.81; 18 1.27,3.81; 19 -1.27,3.81; 20 -3.81,3.81; 21 -6.35,3.81; 22 -8.89,3.81; 23 -11.43,3.81; 24 -13.97,3.81
SO20W = smd 0.66 x 2.032: 1 -5.715,-5.029; 2 -4.445,-5.029; 3 -3.175,-5.029; 4 -1.905,-5.029; 5 -0.635,-5.029; 6 0.635,-5.029; 7 1.905,-5.029; 8 3.175,-5.029; 9 4.445,-5.029; 10 5.715,-5.029; 11 5.715,5.029; 12 4.445,5.029; 13 3.175,5.029; 14 1.905,5.029; 15 0.635,5.029; 16 -0.635,5.029; 17 -1.905,5.029; 18 -3.175,5.029; 19 -4.445,5.029; 20 -5.715,5.029
DIL16 = drill 0.813 long: 1 -8.89,-3.81; 2 -6.35,-3.81; 3 -3.81,-3.81; 4 -1.27,-3.81; 5 1.27,-3.81; 6 3.81,-3.81; 7 6.35,-3.81; 8 8.89,-3.81; 9 8.89,3.81; 10 6.35,3.81; 11 3.81,3.81; 12 1.27,3.81; 13 -1.27,3.81; 14 -3.81,3.81; 15 -6.35,3.81; 16 -8.89,3.81
1X02 = drill 1.016 long: 1 -1.27,0; 2 1.27,0
LED5MM = drill 0.813 octagon: A -1.27,0; K 1.27,0
HC49/S = drill 0.813: 1 -2.413,0; 2 2.413,0
0204/5 = drill 0.813 octagon: 1 -2.54,0; 2 2.54,0
R1206 = smd 1.6 x 1.803: 1 -1.422,0; 2 1.422,0
0204/7 = drill 0.813 octagon: 1 -3.81,0; 2 3.81,0
R0603 = smd 1 x 1.1: 1 -0.85,0; 2 0.85,0
0207/10 = drill 0.813 octagon: 1 -5.08,0; 2 5.08,0
0207/12 = drill 0.813 octagon: 1 -6.35,0; 2 6.35,0
SIL5 = drill 0.813 long: 1 -5.08,0; 2 -2.54,0; 3 0,0; 4 2.54,0; 5 5.08,0
ML64L = drill 0.914 pad 1.6 octagon: 1 -39.37,-1.27; 2 -39.37,1.27; 3 -36.83,-1.27; 4 -36.83,1.27; 5 -34.29,-1.27; 6 -34.29,1.27; 7 -31.75,-1.27; 8 -31.75,1.27; 9 -29.21,-1.27; 10 -29.21,1.27; 11 -26.67,-1.27; 12 -26.67,1.27; 13 -24.13,-1.27; 14 -24.13,1.27; 15 -21.59,-1.27; 16 -21.59,1.27; 17 -19.05,-1.27; 18 -19.05,1.27; 19 -16.51,-1.27; 20 -16.51,1.27; 21 -13.97,-1.27; 22 -13.97,1.27; 23 -11.43,-1.27; 24 -11.43,1.27; 25 -8.89,-1.27; 26 -8.89,1.27; 27 -6.35,-1.27; 28 -6.35,1.27; 29 -3.81,-1.27; 30 -3.81,1.27; 31 -1.27,-1.27; 32 -1.27,1.27; 33 1.27,-1.27; 34 1.27,1.27; 35 3.81,-1.27; 36 3.81,1.27; 37 6.35,-1.27; 38 6.35,1.27; 39 8.89,-1.27; 40 8.89,1.27; 41 11.43,-1.27; 42 11.43,1.27; 43 13.97,-1.27; 44 13.97,1.27; 45 16.51,-1.27; 46 16.51,1.27; 47 19.05,-1.27; 48 19.05,1.27; 49 21.59,-1.27; 50 21.59,1.27; 51 24.13,-1.27; 52 24.13,1.27; 53 26.67,-1.27; 54 26.67,1.27; 55 29.21,-1.27; 56 29.21,1.27; 57 31.75,-1.27; 58 31.75,1.27; 59 34.29,-1.27; 60 34.29,1.27; 61 36.83,-1.27; 62 36.83,1.27; 63 39.37,-1.27; 64 39.37,1.27
DIL28-6 = drill 0.813 long: 1 -16.51,-7.62; 2 -13.97,-7.62; 3 -11.43,-7.62; 4 -8.89,-7.62; 5 -6.35,-7.62; 6 -3.81,-7.62; 7 -1.27,-7.62; 8 1.27,-7.62; 9 3.81,-7.62; 10 6.35,-7.62; 11 8.89,-7.62; 12 11.43,-7.62; 13 13.97,-7.62; 14 16.51,-7.62; 15 16.51,7.62; 16 13.97,7.62; 17 11.43,7.62; 18 8.89,7.62; 19 6.35,7.62; 20 3.81,7.62; 21 1.27,7.62; 22 -1.27,7.62; 23 -3.81,7.62; 24 -6.35,7.62; 25 -8.89,7.62; 26 -11.43,7.62; 27 -13.97,7.62; 28 -16.51,7.62
DIL28 = drill 0.813 long: 1 -16.51,-7.62; 2 -13.97,-7.62; 3 -11.43,-7.62; 4 -8.89,-7.62; 5 -6.35,-7.62; 6 -3.81,-7.62; 7 -1.27,-7.62; 8 1.27,-7.62; 9 3.81,-7.62; 10 6.35,-7.62; 11 8.89,-7.62; 12 11.43,-7.62; 13 13.97,-7.62; 14 16.51,-7.62; 15 16.51,7.62; 16 13.97,7.62; 17 11.43,7.62; 18 8.89,7.62; 19 6.35,7.62; 20 3.81,7.62; 21 1.27,7.62; 22 -1.27,7.62; 23 -3.81,7.62; 24 -6.35,7.62; 25 -8.89,7.62; 26 -11.43,7.62; 27 -13.97,7.62; 28 -16.51,7.62

### Placement (x,y rotation side)
C1  78.11,48.45 270 bottom
C2  98.42,48.45 270 bottom
C3  118.75,48.43 270 bottom
C4  9.53,46.35 0 bottom
C5  42.6,36.88 0 bottom
C6  86.78,18.92 0 bottom
C7  44.77,25.62 90 bottom
C8  38.73,39.88 0 bottom
C9  107.49,105.41 0 bottom
C10  12.7,10.16 270 top
C11  16.51,33.02 270 bottom
C12  95.26,19.37 0 bottom
C13  145.1,29.53 90 bottom
C15  22.33,103.5 0 bottom
C16  10.88,33.02 0 bottom
C18  19.05,100.01 0 bottom
C21  39.5,59.87 225 bottom
C23  31.75,116.84 90 top
CON1  44.77,2.54 180 bottom
D1  8.26,43.81 0 top
IC1  24.13,60.33 90 top
IC2  39.37,73.03 90 top
IC3  26.04,104.78 180 bottom
IC4  112.39,15.56 0 top
IC5  24.77,92.71 270 bottom
IC6  120.65,99.06 0 top
IC7  88.93,16.51 270 bottom
IC9  141.29,17.14 270 top
IC11  53.34,41.91 180 bottom
JP1  8.26,51.44 180 top
JP3  13.97,19.37 0 top
LED1  6.99,24.45 90 top
LED3  111.76,113.03 270 top
LED4  119.38,113.03 270 top
Q1  36.2,37.47 270 top
R1  9.53,48.58 0 top
R2  111.76,107.31 90 bottom
R3  119.38,107.31 90 bottom
R4  8.26,46.35 180 top
R5  9.68,23.18 180 bottom
R6  7.62,53.98 180 top
R7  56.52,30.07 180 bottom
R8  19.05,26.67 180 top
R9  19.37,63.72 90 bottom
R10  19.05,30.48 180 top
R11  56.52,27.62 180 bottom
R12  13.08,41.27 180 bottom
R13  43.31,54.18 270 bottom
R15  8.26,56.52 180 top
R16  8.26,59.05 180 top
R17  97.35,32.07 90 top
RN1  35.56,53.98 270 top
SV2  156.84,56.52 270 top
U$2  106.05,67.94 90 top
U$3  126.36,67.94 90 top
U$4  85.72,67.94 90 top

### Tracks (layer width: path | path; a pad name or v marks a point on that pad's centre or on a via)
!ALE  (via drill 0.6 pad 1.42)
  Top 0.406: v40.96,83.19 v40.96,103.47 | v60.64,83.19 v60.64,50.48 | v85.72,42.23 v85.72,16.51
  Bottom 0.406: IC2.11 38.73,84.45 40.01,83.19 v40.96,83.19 v60.64,83.19 | v60.64,50.48 67.63,50.48 75.88,42.23 v85.72,42.23 | IC3.4 v40.96,103.47 | v85.72,16.51 IC7.2
!RESET  (via drill 0.6 pad 1.42)
  Top 0.406: v107.63,35.88 v107.63,92.08 | v43.81,41.91 v43.81,28.57 | v118.75,35.88 v118.75,22.86
  Bottom 0.406: CON1.41 40.64,26.67 42.55,28.57 v43.81,28.57 | SV2.37 153.99,50.16 140.97,37.15 134.62,37.15 133.35,35.88 v118.75,35.88 v107.63,35.88 R17.2 72.07,35.88 66.67,41.27 46.99,41.27 46.35,41.91 v43.81,41.91 | IC6.1 109.22,93.66 v107.63,92.08 | v118.75,22.86 IC4.16
A0  (via drill 0.6 pad 1.42)
  Top 0.406: v146.69,74.3 v146.69,71.75 | v71.44,61.59 v71.44,75.56 | v40.64,31.11 v40.64,62.87
  Bottom 0.406: U$3.10 v146.69,74.3 121.92,74.3 120.65,75.56 116.84,75.56 115.57,74.3 U$2.10 100.97,74.3 99.69,75.56 96.52,75.56 95.25,74.3 U$4.10 80.64,74.3 79.38,75.56 v71.44,75.56 | SV2.15 153.99,78.11 147.64,71.75 v146.69,71.75 | IC2.19 38.73,64.14 40.01,62.87 v40.64,62.87 64.45,62.87 65.72,61.59 v71.44,61.59 | CON1.20 36.2,26.67 v40.64,31.11
A1  (via drill 0.6 pad 1.42)
  Top 0.406: v70.17,65.41 v70.17,69.22 | v46.35,31.11 v46.35,65.41
  Bottom 0.406: SV2.16 156.84,76.83 153.99,76.83 147.64,70.48 146.05,70.48 144.78,71.75 U$3.9 121.92,71.75 120.65,73.03 116.84,73.03 115.57,71.75 U$2.9 100.97,71.75 99.69,73.03 96.52,73.03 95.25,71.75 U$4.9 80.64,71.75 79.38,73.03 76.83,73.03 73.98,70.17 72.07,70.17 71.12,69.22 v70.17,69.22 | IC2.18 38.73,66.67 40.01,65.41 v46.35,65.41 v70.17,65.41 | v46.35,31.11 42.55,31.11 37.47,26.04 CON1.19
A2  (via drill 0.6 pad 1.42)
  Top 0.406: v47.62,67.94 v47.62,29.84
  Bottom 0.406: SV2.17 153.99,75.56 147.64,69.22 U$3.8 121.92,69.22 120.65,70.48 116.84,70.48 115.57,69.22 U$2.8 100.97,69.22 99.69,70.48 96.52,70.48 95.25,69.22 U$4.8 80.64,69.22 79.38,70.48 75.56,70.48 74.3,69.22 72.39,69.22 71.12,67.94 v47.62,67.94 40.01,67.94 38.73,69.22 IC2.17 | v47.62,29.84 42.55,29.84 38.73,26.04 CON1.18
A3  (via drill 0.6 pad 1.42)
  Top 0.406: v73.03,67.94 v73.03,71.44
  Bottom 0.406: SV2.18 156.84,74.3 153.99,74.3 146.37,66.67 U$3.7 121.92,66.67 120.65,67.94 116.84,67.94 115.57,66.67 U$2.7 100.97,66.67 99.69,67.94 96.52,67.94 95.25,66.67 U$4.7 80.64,66.67 79.38,67.94 v73.03,67.94 | IC2.16 38.73,71.75 40.01,70.48 71.12,70.48 72.07,71.44 v73.03,71.44
A4  (via drill 0.6 pad 1.42)
  Top 0.406: v67.63,73.03 v67.63,66.67 | v73.34,65.41 v73.34,33.34 | v102.23,33.34 v102.23,23.18
  Bottom 0.406: SV2.19 153.99,73.03 145.1,64.14 U$3.6 121.92,64.14 120.65,65.41 116.84,65.41 115.57,64.14 U$2.6 100.97,64.14 99.69,65.41 96.52,65.41 95.25,64.14 U$4.6 80.64,64.14 79.38,65.41 v73.34,65.41 72.07,66.67 v67.63,66.67 | IC2.15 38.73,74.3 40.01,73.03 v67.63,73.03 | v73.34,33.34 v102.23,33.34 | v102.23,23.18 102.23,17.46 100.97,16.19 IC4.2
A5  (via drill 0.6 pad 1.42)
  Top 0.406: v128.91,26.04 v128.91,61.59 | v66.36,75.56 v66.36,62.87
  Bottom 0.406: v128.91,61.59 121.92,61.59 120.65,62.87 116.84,62.87 115.57,61.59 U$2.5 100.97,61.59 99.69,62.87 96.52,62.87 95.25,61.59 U$4.5 80.64,61.59 79.38,62.87 v66.36,62.87 | v128.91,61.59 U$3.5 138.75,61.59 140.02,62.87 145.1,62.87 153.99,71.75 156.84,71.75 SV2.20 | v128.91,61.59 123.83,61.59 | IC2.14 38.73,76.83 40.01,75.56 v66.36,75.56
  Bottom 0.61: v128.91,26.04 IC9.1
A6  (via drill 0.6 pad 1.42)
  Top 0.406: v138.11,59.05 v140.65,61.59 | v130.18,23.5 v130.18,59.05 | v59.37,78.11 v59.37,60.33
  Bottom 0.406: v130.18,59.05 121.92,59.05 120.65,60.33 116.84,60.33 115.57,59.05 U$2.4 100.97,59.05 99.69,60.33 96.52,60.33 95.25,59.05 U$4.4 80.64,59.05 79.38,60.33 76.83,60.33 75.56,59.05 65.41,59.05 64.14,60.33 v59.37,60.33 | v130.18,59.05 U$3.4 | SV2.21 153.99,70.48 145.1,61.59 v140.65,61.59 | v130.18,59.05 125.09,59.05 | IC2.13 38.73,79.38 40.01,78.11 v59.37,78.11
  Bottom 0.61: U$3.4 v138.11,59.05 | IC9.2 v130.18,23.5
A7  (via drill 0.6 pad 1.42)
  Top 0.406: v138.11,56.52 v141.92,60.33 | v131.44,20.95 v131.44,56.52 | v61.91,80.64 v61.91,59.05
  Bottom 0.406: U$3.3 v131.44,56.52 121.92,56.52 120.65,57.78 116.84,57.78 115.57,56.52 U$2.3 100.97,56.52 99.69,57.78 96.52,57.78 95.25,56.52 U$4.3 80.64,56.52 79.38,57.78 65.41,57.78 64.14,59.05 v61.91,59.05 | SV2.22 156.84,69.22 153.99,69.22 145.1,60.33 v141.92,60.33 | IC2.12 38.73,81.92 40.01,80.64 v61.91,80.64
  Bottom 0.61: U$3.3 v138.11,56.52 | IC9.3 v131.44,20.95
A8  (via drill 0.6 pad 1.42)
  Top 0.406: v81.28,57.78 v81.28,84.45
  Bottom 0.406: U$4.25 79.38,59.05 80.64,57.78 v81.28,57.78 95.25,57.78 96.52,59.05 U$2.25 99.69,59.05 100.97,57.78 115.57,57.78 116.84,59.05 U$3.25 120.65,59.05 121.92,57.78 143.83,57.78 153.99,67.94 SV2.23 | IC5.9 80.01,88.27 81.28,87 v81.28,84.45
A8_IN
  Bottom 0.406: IC5.11 19.74,85.78 18.41,84.45 IC1.21
A9  (via drill 0.6 pad 1.42)
  Top 0.406: v143.19,59.05 v140.65,56.52 | v82.55,85.72 v82.55,60.33
  Bottom 0.406: U$4.24 79.38,61.59 80.64,60.33 v82.55,60.33 95.25,60.33 96.52,61.59 U$2.24 99.69,61.59 100.97,60.33 115.57,60.33 116.84,61.59 U$3.24 120.65,61.59 121.92,60.33 139.38,60.33 140.65,59.05 v143.19,59.05 | SV2.24 156.84,66.67 153.99,66.67 143.83,56.52 v140.65,56.52 | IC5.8 80.01,89.53 82.55,87 v82.55,85.72
A9_IN
  Bottom 0.406: IC1.22 18.41,81.92 21.59,85.09 21.59,87.95 21.27,88.27 IC5.12
A10  (via drill 0.6 pad 1.42)
  Top 0.406: v127.64,67.94 v127.64,52.7 | v83.82,84.45 v83.82,67.94
  Bottom 0.406: U$4.21 79.38,69.22 80.64,67.94 v83.82,67.94 95.25,67.94 96.52,69.22 U$2.21 99.69,69.22 100.97,67.94 115.57,67.94 116.84,69.22 U$3.21 120.65,69.22 121.92,67.94 v127.64,67.94 | v127.64,52.7 141.29,52.7 153.99,65.41 SV2.25 | IC5.7 80.01,90.81 83.82,87 v83.82,84.45
A10_IN
  Bottom 0.406: IC1.23 18.41,79.38 22.54,83.5 22.54,88.27 21.27,89.53 IC5.13
A11  (via drill 0.6 pad 1.42)
  Top 0.406: v136.84,62.87 v136.84,51.44 | v85.09,85.72 v85.09,62.87
  Bottom 0.406: U$4.23 79.38,64.14 80.64,62.87 v85.09,62.87 95.25,62.87 96.52,64.14 U$2.23 99.69,64.14 100.97,62.87 115.57,62.87 116.84,64.14 U$3.23 120.65,64.14 121.92,62.87 v136.84,62.87 | SV2.26 156.84,64.14 153.99,64.14 141.29,51.44 v136.84,51.44 | IC5.6 80.01,92.08 85.09,87 v85.09,85.72
A11_IN
  Bottom 0.406: IC1.24 18.41,76.83 23.5,81.92 23.5,88.58 21.27,90.81 IC5.14
A12  (via drill 0.6 pad 1.42)
  Top 0.406: v138.43,53.98 v138.43,50.16 | v86.36,53.98 v86.36,84.45
  Bottom 0.406: U$3.2 121.92,53.98 120.65,55.24 116.84,55.24 115.57,53.98 U$2.2 100.97,53.98 99.69,55.24 96.52,55.24 95.25,53.98 U$4.2 v86.36,53.98 | v138.43,50.16 141.29,50.16 153.99,62.87 SV2.27 | IC5.5 80.01,93.34 86.36,87 v86.36,84.45
  Bottom 0.61: U$3.2 v138.43,53.98
A12_IN
  Bottom 0.406: IC1.25 18.41,74.3 24.45,80.33 24.45,88.9 21.27,92.08 IC5.15
A13  (via drill 0.6 pad 1.42)
  Top 0.406: v140.34,53.98 v140.34,48.9 | v87.63,55.24 v87.63,85.72
  Bottom 0.406: U$4.26 79.38,56.52 80.64,55.24 v87.63,55.24 95.25,55.24 96.52,56.52 U$2.26 99.69,56.52 100.97,55.24 115.57,55.24 116.84,56.52 U$3.26 120.65,56.52 121.92,55.24 139.06,55.24 v140.34,53.98 | SV2.28 156.84,61.59 153.99,61.59 141.29,48.9 v140.34,48.9 | IC5.4 80.01,94.61 87.63,87 v87.63,85.72
A13_IN
  Bottom 0.406: IC1.26 18.41,71.75 25.4,78.74 25.4,89.22 21.27,93.34 IC5.16
A14  (via drill 0.6 pad 1.42)
  Top 0.406: v115.89,45.72 v115.89,51.44 | v88.9,51.44 v88.9,84.45
  Bottom 0.406: SV2.29 153.99,60.33 140.65,46.99 132.08,46.99 130.81,45.72 v115.89,45.72 | v88.9,51.44 U$4.1 95.25,51.44 96.52,52.7 99.69,52.7 101.28,51.44 U$2.1 | IC5.3 80.01,95.89 88.9,87 v88.9,84.45
  Bottom 0.61: U$2.1 v115.89,51.44
A14_IN
  Bottom 0.406: IC1.27 18.41,69.22 26.35,77.15 26.35,89.53 21.27,94.61 IC5.17
A15  (via drill 0.6 pad 1.42)
  Top 0.406: v100.65,90.81 v100.65,44.45 | v120.02,21.59 v120.02,44.45
  Bottom 0.406: SV2.30 156.84,59.05 153.99,59.05 140.65,45.72 132.08,45.72 130.81,44.45 v120.02,44.45 v100.65,44.45 | IC5.2 94.3,97.16 v100.65,90.81 | v120.02,21.59 120.02,18.1 121.28,16.83 IC4.10
A15_IN
  Bottom 0.406: IC1.28 18.41,66.67 27.3,75.56 27.3,90.17 21.59,95.89 IC5.18
AEN  (via drill 0.6 pad 1.42)
  Top 0.406: v132.72,18.41 v132.72,32.07 | v74.61,32.07 v74.61,60.33 | v17.46,97.16 v12.06,97.16 | v112.39,32.07 v112.39,22.86
  Bottom 0.406: SV2.42 156.84,43.81 152.72,43.81 140.97,32.07 v132.72,32.07 v112.39,32.07 v74.61,32.07 | 19.05,62.87 38.73,62.87 40.01,61.59 IC2.1 64.14,61.59 65.41,60.33 v74.61,60.33 | 19.05,62.87 15.24,62.87 12.06,66.04 v12.06,97.16 | IC5.19 v17.46,97.16 | R9.1 19.05,62.87 | v112.39,22.86 112.39,17.46 113.67,16.19 IC4.7
  Bottom 0.61: v132.72,18.41 IC9.4
ALE  (via drill 0.6 pad 1.42)
  Top 0.406: v10.79,101.6 v26.04,101.6
  Bottom 0.406: IC1.30 15.24,61.59 10.79,66.04 v10.79,101.6 | v26.04,101.6 IC3.2
CF_CS0  (via drill 0.6 pad 1.42)
  Top 0.406: v52.7,31.75 v60.33,31.75
  Bottom 0.406: CON1.7 v52.7,31.75 | IC11.19 48.9,38.51 49.23,38.84 59.61,38.84 60.33,38.12 v60.33,31.75 60.33,26.04 78.74,7.62 88.58,7.62 90.17,6.03 107,6.03 110.49,9.53 116.84,9.53 117.47,10.16 117.47,16.51 116.2,17.78 IC4.17
CF_D0
  Bottom 0.406: IC11.16 52.7,35.24 49.85,32.38 40.01,32.38 34.92,27.3 CON1.21
CF_D1
  Bottom 0.406: IC11.17 51.44,35.24 49.53,33.34 39.69,33.34 33.66,27.3 CON1.22
CF_D2
  Bottom 0.406: IC11.18 50.16,35.24 49.21,34.29 39.37,34.29 32.38,27.3 CON1.23
CF_D3
  Bottom 0.406: CON1.2 IC11.11
CF_D4
  Bottom 0.406: CON1.3 IC11.12
CF_D5
  Bottom 0.406: CON1.4 IC11.13
CF_D6
  Bottom 0.406: CON1.5 IC11.14
CF_D7
  Bottom 0.406: CON1.6 IC11.15
CF_DELAYED_RD  (via drill 0.6 pad 1.42)
  Top 0.406: v49.53,26.04 v65.72,26.04
  Bottom 0.406: v49.53,26.04 CON1.34 | IC4.23 100.97,17.46 99.69,16.19 99.69,10.48 98.74,9.53 79.38,9.53 65.72,23.18 v65.72,26.04
CF_DELAYED_WR  (via drill 0.6 pad 1.42)
  Top 0.406: v48.26,24.77 v64.45,24.77
  Bottom 0.406: CON1.35 v48.26,24.77 | IC4.21 106.05,15.88 104.78,14.61 104.78,10.16 103.19,8.57 79.06,8.57 64.45,23.18 v64.45,24.77
CLK  (via drill 0.6 pad 1.42)
  Top 0.406: v99.69,25.72 v99.69,38.42
  Bottom 0.406: SV2.36 156.84,51.44 153.99,51.44 140.97,38.42 v99.69,38.42 72.07,38.42 67.45,43.04 47.51,43.04 46.42,44.13 34.61,44.13 33.02,42.55 30.48,42.55 29.21,43.81 IC1.37 | v99.69,25.72 99.69,17.46 98.42,16.19 IC4.1
CS_0
  Bottom 0.406: SV2.57 150.5,24.77 149.22,23.5 IC9.15
CS_1
  Bottom 0.406: SV2.58 156.84,23.5 151.76,23.5 149.22,20.95 IC9.14
CS_2
  Bottom 0.406: SV2.59 153.03,22.23 149.22,18.41 IC9.13
CS_3
  Bottom 0.406: SV2.60 156.84,20.95 154.31,20.95 149.22,15.88 IC9.12
CS_4
  Bottom 0.406: IC9.11 149.22,13.34 SV2.61
CS_5
  Bottom 0.406: SV2.62 156.84,18.41 156.84,15.88 149.22,8.26 IC9.9
CS_6
  Bottom 0.406: IC9.10 149.22,10.79 SV2.63
CS_EPROM  (via drill 0.6 pad 1.42)
  Top 0.406: v123.83,24.13 v123.83,70.48
  Bottom 0.406: U$3.20 120.65,71.75 121.92,70.48 v123.83,70.48
  Bottom 0.61: v123.83,24.13 IC4.14
CS_RAM1  (via drill 0.6 pad 1.42)
  Top 0.406: v90.81,70.48 v90.81,7.3
  Bottom 0.406: U$4.20 79.38,71.75 80.64,70.48 v90.81,70.48 | v90.81,7.3 107,7.3 109.86,10.16 109.86,16.51 108.58,17.78 IC4.20
CS_RAM2  (via drill 0.6 pad 1.42)
  Top 0.406: v111.12,70.48 v111.12,21.59
  Bottom 0.406: v111.12,70.48 100.97,70.48 99.69,71.75 U$2.20
  Bottom 0.61: v111.12,21.59 IC4.19
D0  (via drill 0.6 pad 1.42)
  Top 0.406: v108.9,89.53 v108.9,76.83 | v146.69,76.83 v146.69,84.45 | v75.56,78.11 v75.56,64.14 | v51.44,49.09 v51.44,64.14
  Bottom 0.406: v146.69,76.83 U$3.11 121.92,76.83 120.65,78.11 116.84,78.11 115.57,76.83 U$2.11 v108.9,76.83 100.97,76.83 99.69,78.11 96.52,78.11 95.25,76.83 U$4.11 80.64,76.83 79.38,78.11 v75.56,78.11 | SV2.7 150.5,88.27 v146.69,84.45 | IC1.12 33.02,64.14 34.29,65.41 38.73,65.41 40.01,64.14 IC2.2 v51.44,64.14 v75.56,64.14 | v108.9,89.53 111.44,89.53 114.3,92.39 IC6.3 | IC11.4 v51.44,49.09
D1  (via drill 0.6 pad 1.42)
  Top 0.406: v106.36,89.22 v106.36,79.38 | v148.59,79.38 v148.59,84.45 | v63.82,66.67 v63.82,80.64 | v50.16,50.35 v50.16,66.67
  Bottom 0.406: v148.59,79.38 U$3.12 121.92,79.38 120.65,80.64 116.84,80.64 115.57,79.38 U$2.12 v106.36,79.38 100.97,79.38 99.69,80.64 96.52,80.64 95.25,79.38 U$4.12 80.64,79.38 79.38,80.64 v63.82,80.64 | SV2.8 156.84,87 151.13,87 v148.59,84.45 | IC1.13 33.02,66.67 34.29,67.94 38.73,67.94 40.01,66.67 IC2.3 v50.16,66.67 v63.82,66.67 | IC6.4 116.84,91.76 112.08,87 108.58,87 v106.36,89.22 | IC11.3 v50.16,50.35
D2  (via drill 0.6 pad 1.42)
  Top 0.406: v124.46,84.45 v124.46,81.92 | v150.81,81.92 v150.81,84.45 | v65.09,69.22 v65.09,83.19 | v48.9,49.09 v48.9,69.22
  Bottom 0.406: v150.81,81.92 U$3.13 v124.46,81.92 121.92,81.92 120.65,83.19 116.84,83.19 115.57,81.92 U$2.13 100.97,81.92 99.69,83.19 96.52,83.19 95.25,81.92 U$4.13 80.64,81.92 79.38,83.19 v65.09,83.19 | SV2.9 152.08,85.72 v150.81,84.45 | IC1.14 33.02,69.22 34.29,70.48 38.73,70.48 40.01,69.22 IC2.4 v48.9,69.22 v65.09,69.22 | v124.46,84.45 IC6.7 | IC11.2 v48.9,49.09
D3  (via drill 0.6 pad 1.42)
  Top 0.406: v70.17,71.75 v70.17,84.45 | v57.78,50.35 v57.78,71.75
  Bottom 0.406: 127,83.19 121.92,83.19 120.65,84.45 U$3.15 116.84,84.45 115.57,83.19 100.97,83.19 99.69,84.45 U$2.15 96.52,84.45 95.25,83.19 80.64,83.19 79.38,84.45 U$4.15 v70.17,84.45 | 127,83.19 152.08,83.19 153.35,84.45 156.84,84.45 SV2.10 | IC1.15 33.02,71.75 34.29,73.03 38.73,73.03 40.01,71.75 IC2.5 v57.78,71.75 v70.17,71.75 | 127,83.19 IC6.8 | IC11.9 v57.78,50.35
D4  (via drill 0.6 pad 1.42)
  Top 0.406: v125.73,85.72 v125.73,80.64 | v73.03,76.83 v73.03,81.92 | v56.52,49.09 v56.52,74.3
  Bottom 0.406: SV2.11 153.99,83.19 151.45,80.64 v125.73,80.64 121.92,80.64 120.65,81.92 U$3.16 116.84,81.92 115.57,80.64 100.97,80.64 99.69,81.92 U$2.16 96.52,81.92 95.25,80.64 80.64,80.64 79.38,81.92 U$4.16 v73.03,81.92 | v73.03,76.83 69.53,76.83 66.99,74.3 v56.52,74.3 IC2.6 40.01,74.3 38.73,75.56 34.29,75.56 33.02,74.3 IC1.16 | v125.73,85.72 125.73,96.52 127,97.79 IC6.13 | IC11.8 v56.52,49.09
D5  (via drill 0.6 pad 1.42)
  Top 0.406: v123.19,86.04 v123.19,78.11 | v67.63,76.83 v67.63,79.38 | v55.24,50.35 v55.24,76.83
  Bottom 0.406: SV2.12 156.84,81.92 153.99,81.92 150.18,78.11 v123.19,78.11 121.92,78.11 120.65,79.38 U$3.17 116.84,79.38 115.57,78.11 100.97,78.11 99.69,79.38 U$2.17 96.52,79.38 95.25,78.11 80.64,78.11 79.38,79.38 U$4.17 v67.63,79.38 | IC1.17 33.02,76.83 34.29,78.11 38.73,78.11 40.01,76.83 IC2.7 v55.24,76.83 v67.63,76.83 | v123.19,86.04 123.19,96.52 124.46,97.79 IC6.14 | IC11.7 v55.24,50.35
D6  (via drill 0.6 pad 1.42)
  Top 0.406: v111.44,88.27 v111.44,75.56 | v53.98,49.09 v53.98,79.38
  Bottom 0.406: SV2.13 153.99,80.64 148.91,75.56 121.92,75.56 120.65,76.83 U$3.18 116.84,76.83 115.57,75.56 v111.44,75.56 100.97,75.56 99.69,76.83 U$2.18 96.52,76.83 95.25,75.56 80.64,75.56 79.38,76.83 U$4.18 74.93,76.83 73.66,78.11 66.99,78.11 65.72,79.38 v53.98,79.38 IC2.8 40.01,79.38 38.73,80.64 34.29,80.64 33.02,79.38 IC1.18 | IC6.17 116.84,97.79 115.57,96.52 115.57,92.39 v111.44,88.27 | IC11.6 v53.98,49.09
D7  (via drill 0.6 pad 1.42)
  Top 0.406: v110.17,90.81 v110.17,73.03 | v68.9,81.92 v68.9,74.3 | v52.7,81.92 v52.7,50.35
  Bottom 0.406: SV2.14 156.84,79.38 153.99,79.38 147.64,73.03 121.92,73.03 120.65,74.3 U$3.19 116.84,74.3 115.57,73.03 v110.17,73.03 100.97,73.03 99.69,74.3 U$2.19 96.52,74.3 95.25,73.03 80.64,73.03 79.38,74.3 U$4.19 v68.9,74.3 | IC1.19 33.02,81.92 34.29,83.19 38.73,83.19 40.01,81.92 IC2.9 v52.7,81.92 v68.9,81.92 | IC6.18 114.3,97.79 113.03,96.52 113.03,92.39 111.44,90.81 v110.17,90.81 | IC11.5 v52.7,50.35
GND  (via drill 0.6 pad 1.42, 0.6 pad 1.78)
  Top 0.61: v1.91,100.01 v16.19,100.01 | v140.34,96.84 v140.34,87.63 | v136.84,48.58 v136.84,30.48 | v70.8,44.45 v70.8,7.94 | v23.5,33.97 v14.61,33.97 | v27.94,66.04 v27.94,37.78 | v5.71,36.51 v9.21,40.01 | v93.34,95.25 v93.34,116.52 | v71.12,116.84 v71.12,111.76
  Bottom 0.406: CON1.50 29.21,25.4 | CON1.1 60.33,16.51 51.44,16.51 | CON1.8 51.44,16.51 | CON1.9 50.16,16.51 | CON1.17 40.01,17.46 39.69,17.14 | CON1.39 43.18,16.51 | CON1.14 43.81,16.51 | CON1.15 42.55,16.51 43.18,16.51 | CON1.10 48.9,16.51 | CON1.11 47.62,16.51 | CON1.12 46.35,16.51 | 43.18,16.51 43.81,16.51 | 43.81,16.51 46.35,16.51 | 46.35,16.51 47.62,16.51 | 47.62,16.51 48.9,16.51 | 48.9,16.51 50.16,16.51 | 50.16,16.51 51.44,16.51 | 41.59,17.14 41.27,17.46 CON1.16 41.27,26.04 41.91,26.67
  pour Bottom (isolate 0.406, no thermals): 0,122.56 0,0 167.64,0 167.64,122.56
HLDA
  Bottom 0.406: SV2.38 156.84,48.9 153.99,48.9 140.97,35.88 134.62,35.88 133.35,34.61 72.07,34.61 66.22,40.46 43.36,40.46 41.59,42.23 35.24,42.23 33.02,40.01 30.48,40.01 29.21,41.27 IC1.38
HRQ  (via drill 0.6 pad 1.42)
  Top 0.406: v106.36,33.34 v106.36,39.69
  Bottom 0.406: SV2.41 152.72,45.09 140.97,33.34 v106.36,33.34 | v106.36,39.69 72.07,39.69 67.91,43.85 47.84,43.85 46.61,45.09 15.24,45.09 14.29,44.13 14.29,41.27 | 14.29,41.27 14.29,40.01 15.56,38.73 IC1.39 | R12.2 14.29,41.27
INT
  Bottom 0.406: SV2.32 156.84,56.52 153.99,56.52 140.65,43.18 87.95,43.18 86.68,44.45 76.2,44.45 67.63,53.02 43.18,53.02 | 43.18,53.02 41.91,53.02 37.15,57.78 34.29,57.78 33.02,59.05 IC1.10 | R13.2 43.31,53.15 43.18,53.02
INTA
  Bottom 0.406: SV2.33 153.99,55.24 140.97,42.23 87.63,42.23 86.36,43.5 75.88,43.5 67.31,52.07 41.27,52.07 38.1,55.24 30.48,55.24 29.84,55.88 29.84,60.96 30.48,61.59 IC1.11
IO_M  (via drill 0.6 pad 1.42)
  Top 0.406: v19.05,38.73 v19.05,51.44 | v135.25,34.61 v135.25,3.81 | v92.08,17.46 v92.08,3.81
  Bottom 0.406: v19.05,38.73 19.05,14.61 23.81,9.84 71.75,9.84 77.79,3.81 v92.08,3.81 v135.25,3.81 | v19.05,51.44 IC1.34 | SV2.39 153.99,47.62 140.97,34.61 v135.25,34.61
  Bottom 0.61: IC7.1 v92.08,17.46
IO_M_SYNC  (via drill 0.6 pad 1.42)
  Top 0.406: v93.66,13.97 v106.05,13.97 | v107.31,15.24 v125.09,15.24
  Bottom 0.406: IC9.6 131.76,13.34 129.86,15.24 v125.09,15.24 | IC7.4 87.62,14.61 88.27,13.97 v93.66,13.97
  Bottom 0.61: IC4.4 v106.05,13.97 v107.31,15.24
LOCAL_IO_CS
  Bottom 0.406: IC4.11 123.83,13.34 124.46,13.97 129.54,13.97 132.72,10.79 IC9.7
LOCAL_PORT_CS  (via drill 0.6 pad 1.42)
  Top 0.406: v103.5,21.91 v103.5,87.63
  Bottom 0.406: IC6.11 132.08,104.14 130.18,106.05 122.56,106.05 120.65,104.14 120.65,99.06 118.11,96.52 118.11,91.76 112.39,86.04 108.27,86.04 106.68,87.63 v103.5,87.63
  Bottom 0.61: v103.5,21.91 IC4.22
N$1
  Bottom 0.406: IC1.1 35.05,36.2 Q1.2
N$2
  Bottom 0.406: IC1.2 35.05,38.73 Q1.1
  Bottom 0.61: Q1.1 C8.2
N$3
  Bottom 0.61: IC1.9 RN1.2
N$4
  Bottom 0.61: IC1.8 RN1.3
N$5
  Bottom 0.813: IC6.16 R3.1
N$6
  Bottom 0.61: IC1.7 RN1.4
N$7
  Bottom 0.61: IC1.6 RN1.5
N$8
  Bottom 0.813: R2.2 LED3.K
N$9
  Bottom 0.813: R3.2 LED4.K
N$10
  Bottom 0.813: IC6.19 R2.1
N$11
  Bottom 0.406: CON1.44 36.83,18.73 34.29,16.19 28.26,16.19 25.4,19.05 R8.1
N$12
  Bottom 0.406: CON1.36 46.99,25.63 R7.1
N$13
  Bottom 0.406: CON1.46 34.29,18.73 33.66,18.1 28.89,18.1 27.62,19.37 27.62,28.26 R10.1
N$14
  Bottom 0.813: R1.1 JP1.2
N$15
  Bottom 0.61: R5.1 LED1.A
N$16  (via drill 0.6 pad 1.42)
  Top 0.406: v25.4,28.57 v10.16,28.57
  Bottom 0.406: CON1.45 35.56,18.73 33.97,17.14 28.57,17.14 26.67,19.05 26.67,27.3 v25.4,28.57
  Bottom 0.61: LED1.K 9.21,25.72 10.16,26.67 v10.16,28.57
N$23  (via drill 0.6 pad 1.27)
  other vias: 5,117.39
N$24  (via drill 0.6 pad 1.27)
  other vias: 162.48,5
N$25  (via drill 0.6 pad 1.27)
  other vias: 162.48,117.39
N$29
  Bottom 0.406: CON1.32 52.07,24.13 51.44,24.77 R11.1
N$37  (via drill 0.6 pad 1.27)
  other vias: 5,5
OUT_1
  Bottom 0.406: SV2.3 131.44,93.34 130.81,93.98 130.81,96.52 129.54,97.79 IC6.12
OUT_2  (via drill 0.6 pad 1.42)
  Top 0.406: v132.08,92.08 v128.27,92.08
  Bottom 0.406: SV2.4 156.84,92.08 v132.08,92.08 | IC6.15 121.92,104.14 122.87,105.09 127.32,105.09 128.27,104.14 v128.27,92.08
OUT_3
  Bottom 0.406: SV2.5 131.44,90.81 129.54,92.71 IC6.9
OUT_4  (via drill 0.6 pad 1.42)
  Top 0.406: v119.38,89.53 v128.27,89.53
  Bottom 0.406: v128.27,89.53 156.84,89.53 SV2.6 | IC6.5 v119.38,89.53
RD  (via drill 0.6 pad 1.42)
  Top 0.406: v114.94,40.96 v114.94,21.59 | v125.09,65.41 v125.09,40.96
  Bottom 0.406: IC1.32 18.41,56.52 22.23,52.7 39.05,52.7 40.64,51.12 46.67,51.12 47.62,50.16 IC11.1 47.62,45.21 48.17,44.67 68.36,44.67 72.07,40.96 v114.94,40.96 v125.09,40.96 140.97,40.96 153.99,53.98 156.84,53.98 SV2.34 | U$4.22 79.38,66.67 80.64,65.41 95.25,65.41 96.52,66.67 U$2.22 99.69,66.67 100.97,65.41 115.57,65.41 116.84,66.67 U$3.22 120.65,66.67 121.92,65.41 v125.09,65.41 | v114.94,21.59 114.94,17.46 116.2,16.19 IC4.8
  Bottom 0.61: R15.1 IC1.32
RDYIN  (via drill 0.6 pad 1.42)
  Top 0.406: v135.89,97.16 v100.65,97.16 | v9.53,98.42 v33.02,98.42
  Bottom 0.406: SV2.1 154.31,94.61 138.43,94.61 v135.89,97.16 | IC1.35 15.24,48.9 R6.1 9.53,54.61 v9.53,98.42 | v33.02,98.42 99.38,98.42 v100.65,97.16
RES_IN
  Bottom 0.61: C4.1 R4.1
  Bottom 0.813: R4.1 IC1.36 | R4.1 D1.A | R4.1 R1.2
RESET  (via drill 0.6 pad 1.42)
  Top 0.406: v132.72,44.45 v132.72,37.15 | v109.86,37.15 v109.86,22.86
  Bottom 0.406: IC1.3 33.02,41.27 34.92,43.18 46.23,43.18 47.18,42.23 66.99,42.23 72.07,37.15 v109.86,37.15 v132.72,37.15 | SV2.31 153.99,57.78 140.65,44.45 v132.72,44.45 | v109.86,22.86 109.86,17.78 111.12,16.51 IC4.6
ROM_SHADOW  (via drill 0.6 pad 1.42)
  Top 0.406: v121.92,87.31 v121.92,24.13
  Bottom 0.406: IC6.6 v121.92,87.31 | v121.92,24.13 109.22,24.13 107.31,22.23 107.31,17.78 108.58,16.51 IC4.5
VCC  (via drill 0.6 pad 1.42, 0.6 pad 1.78)
  Top 0.61: v87.63,28.58 v87.63,49.4 | v37.78,61.59 v37.78,114.3 | v45.09,36.88 v45.09,114.3 | v43.18,24.77 v12.7,24.82 | v95.89,49.4 v95.89,114.3
  Bottom 0.406: C16.+ 12.38,32.7 12.7,32.38 | IC11.20 47.62,38.73 48.54,39.65 59.94,39.65 61.59,38 R7.2 R11.2 | CON1.38 44.45,24.42 C7.1 45.09,24.47 CON1.13 | R6.2 4.45,53.98 | C9.1 109.22,105.41 | C6.1 87.63,19.05 87.62,19.05 | C15.1
  Bottom 0.61: C15.1 23.18,99.69 21.91,98.42 IC5.20 19.9,98.42 C18.1 | C15.1 23.18,114.3 | U$3.1 U$3.28 | v43.18,24.77 C7.1 | IC11.20 v45.09,36.88 | C21.1 38.9,60.48 v37.78,61.59 | 12.38,23.18 12.7,22.86 | 127.19,28.39 127,28.58 | IC3.5 23.21,103.47 C15.1 | IC7.5 87.62,19.05 v87.62,28.57 v87.63,28.58
  Bottom 0.813: C11.1 IC1.40 | C13.1 | C5.1 v45.09,36.88 | IC2.20 v37.78,61.59 | R5.2 12.38,23.18 | R17.1 97.35,25.21 98.42,24.13 IC4.24
  Bottom 1.016: IC9.16 C13.1 127,28.58 97.16,28.58 | C2.1 U$2.28 | U$4.28 C1.1 v87.63,49.4 v95.89,49.4 C2.1 | 118.72,49.4 118.72,51.41 U$3.28 U$3.27 | C2.1 118.72,49.4 | 118.72,49.4 C3.1 | C12.1 IC4.24 | v87.63,28.58 97.16,28.58 | R17.1 97.35,28.39 97.16,28.58
  Bottom 1.27: LED4.A LED3.A 109.22,114.31 | IC1.40 12.7,36.2 | 12.7,36.2 12.7,32.38 R10.2 R8.2 v12.7,24.82 12.7,22.86 JP3.1 C10.+ | 12.7,36.2 9.53,36.2 4.45,41.27 D1.C R4.2 4.45,53.98 R15.2 R16.2 4.45,104.78 13.97,114.3 23.18,114.3 C23.+ v37.78,114.3 v45.09,114.3 v95.89,114.3 109.21,114.3 109.22,114.31 | 109.22,114.31 109.22,105.41 IC6.20
WR  (via drill 0.6 pad 1.42)
  Top 0.406: v20.32,40.01 v20.32,59.05 | v117.47,39.69 v117.47,21.59 | v109.54,52.7 v109.54,39.69
  Bottom 0.406: v20.32,40.01 20.32,14.61 24.13,10.79 72.07,10.79 77.79,5.08 107.31,5.08 110.81,8.57 117.47,8.57 118.75,9.84 IC4.9 118.75,16.19 117.47,17.46 v117.47,21.59 | v20.32,59.05 IC1.31 | SV2.35 153.99,52.7 140.97,39.69 v117.47,39.69 v109.54,39.69 | 77.47,53.98 U$4.27 79.38,53.98 80.64,52.7 95.25,52.7 96.52,53.98 U$2.27 99.69,53.98 100.97,52.7 v109.54,52.7
  Bottom 0.61: R16.1 IC1.31